# EAGLE schematic Module_BaseBoard _2.0 (EAGLE 9.2.1)

## Sheet 1 of 7: CM5 MODULE
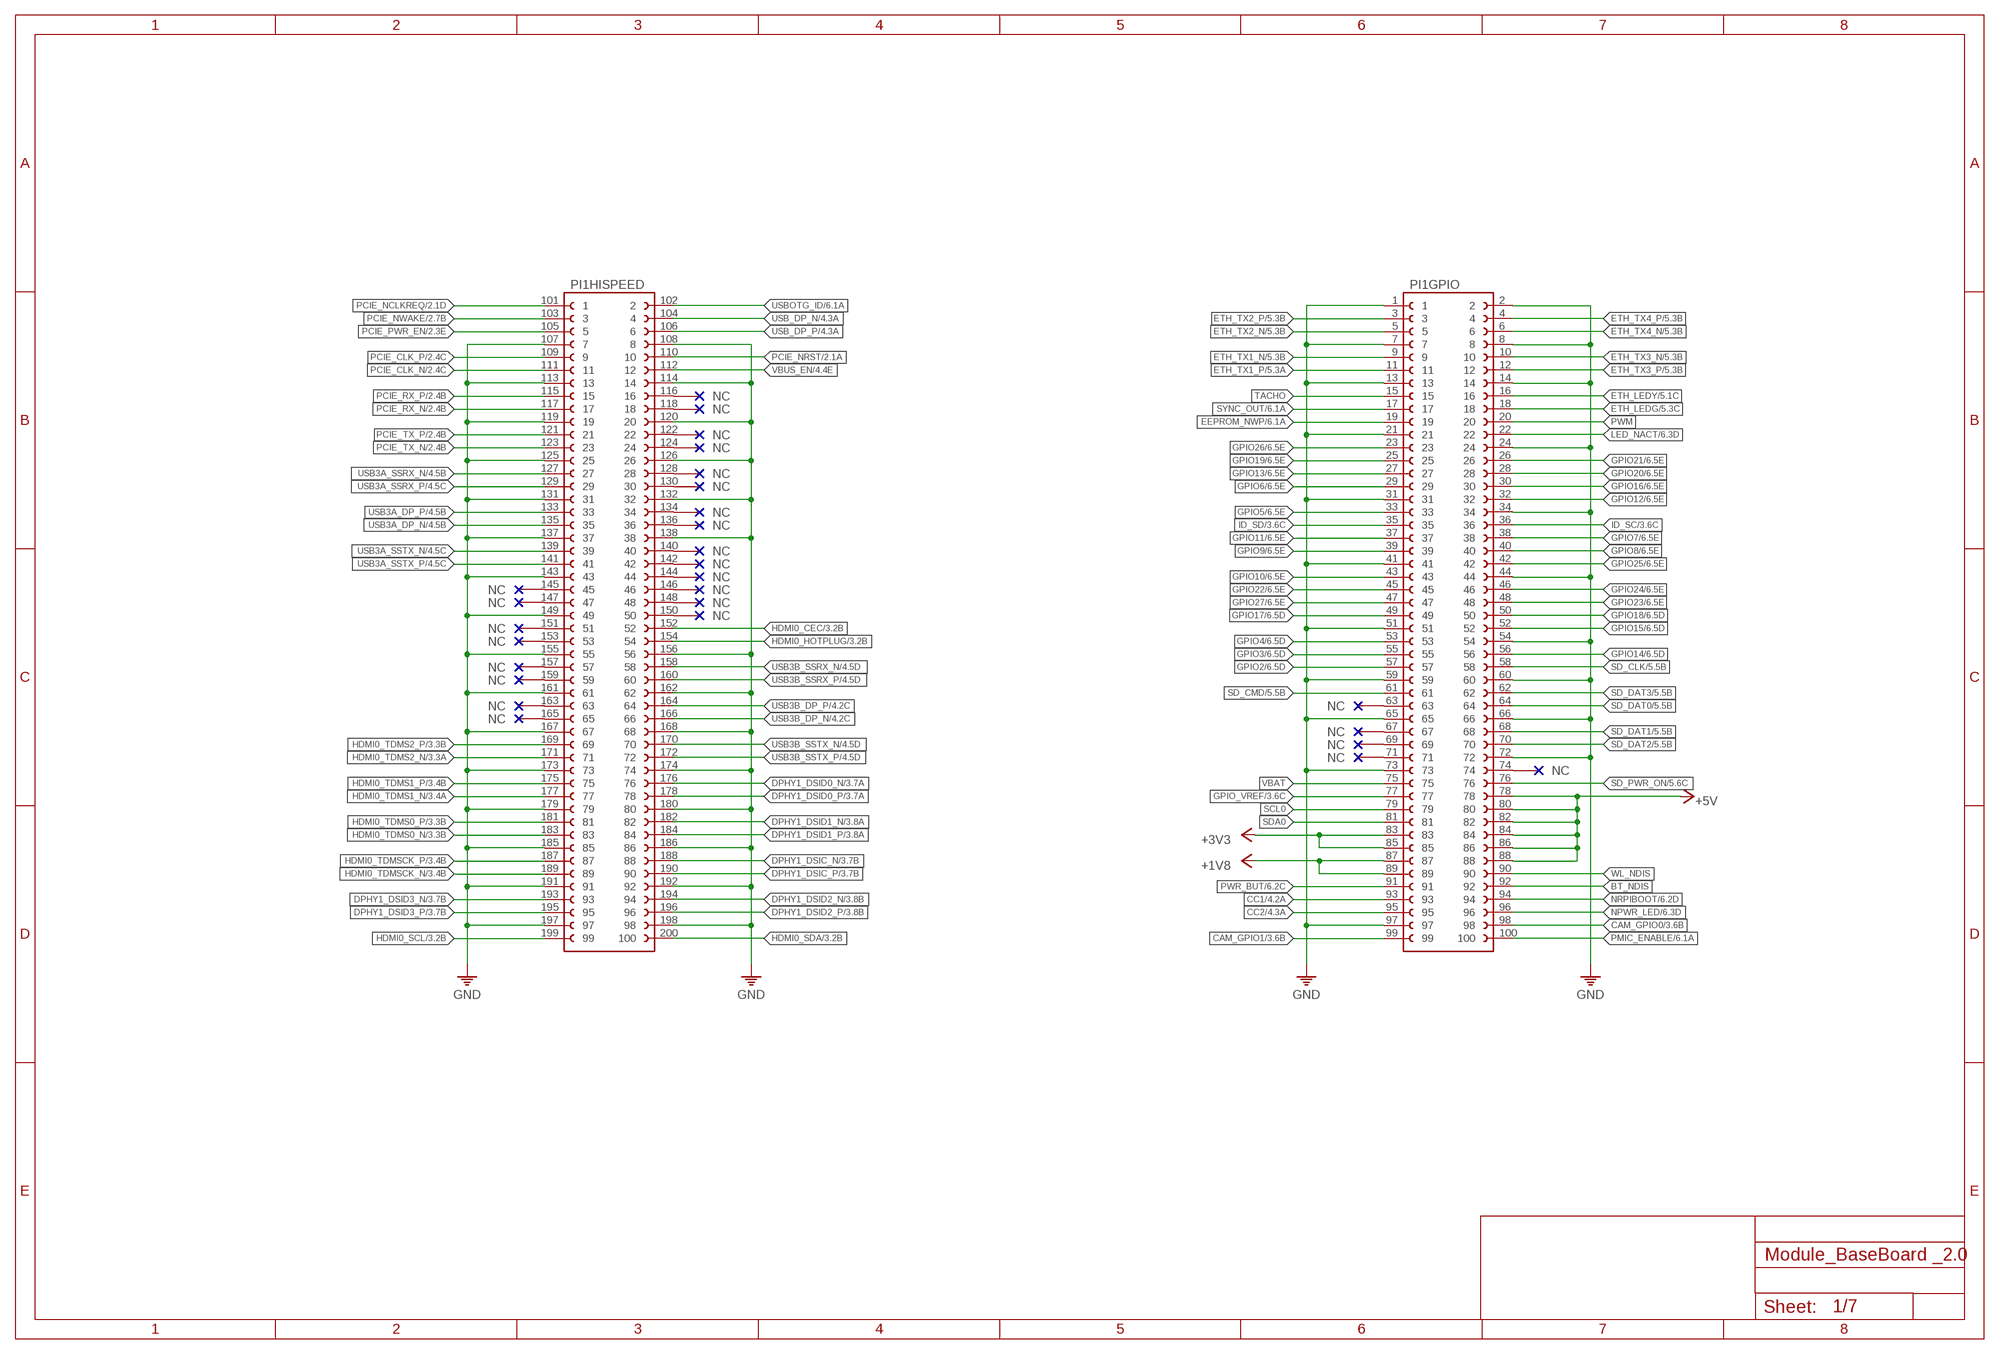
[diagram p0: schematic, sheet 1]

### Parts
PI1  RASPBERRY_CM5  [CM5]

### Nets
+1V8: PI1.87 PI1.89 ; also sheet 6
+3V3: PI1.83 PI1.85 ; also sheet 2,3,4,5,6,7
+5V: PI1.78 PI1.80 PI1.82 PI1.84 PI1.86 PI1.88 ; also sheet 2,3,4,6,7
BT_NDIS: PI1.92
CAM_GPIO0: PI1.98 ; also sheet 3
CAM_GPIO1: PI1.99 ; also sheet 3
CC1: PI1.93 ; also sheet 4
CC2: PI1.95 ; also sheet 4
DPHY1_DSIC_N [100R_DIFFPAIR]: PI1.188 ; also sheet 3
DPHY1_DSIC_P [100R_DIFFPAIR]: PI1.190 ; also sheet 3
DPHY1_DSID0_N [100R_DIFFPAIR]: PI1.176 ; also sheet 3
DPHY1_DSID0_P [100R_DIFFPAIR]: PI1.178 ; also sheet 3
DPHY1_DSID1_N [100R_DIFFPAIR]: PI1.182 ; also sheet 3
DPHY1_DSID1_P [100R_DIFFPAIR]: PI1.184 ; also sheet 3
DPHY1_DSID2_N [100R_DIFFPAIR]: PI1.194 ; also sheet 3
DPHY1_DSID2_P [100R_DIFFPAIR]: PI1.196 ; also sheet 3
DPHY1_DSID3_N [100R_DIFFPAIR]: PI1.193 ; also sheet 3
DPHY1_DSID3_P [100R_DIFFPAIR]: PI1.195 ; also sheet 3
EEPROM_NWP: PI1.19 ; also sheet 6
ETH_LEDG: PI1.18 ; also sheet 5
ETH_LEDY: PI1.16 ; also sheet 5
ETH_TX1_N [100R_DIFFPAIR]: PI1.9 ; also sheet 5
ETH_TX1_P [100R_DIFFPAIR]: PI1.11 ; also sheet 5
ETH_TX2_N [100R_DIFFPAIR]: PI1.5 ; also sheet 5
ETH_TX2_P [100R_DIFFPAIR]: PI1.3 ; also sheet 5
ETH_TX3_N [100R_DIFFPAIR]: PI1.10 ; also sheet 5
ETH_TX3_P [100R_DIFFPAIR]: PI1.12 ; also sheet 5
ETH_TX4_N [100R_DIFFPAIR]: PI1.6 ; also sheet 5
ETH_TX4_P [100R_DIFFPAIR]: PI1.4 ; also sheet 5
GND: PI1.1 PI1.2 PI1.7 PI1.8 PI1.13 PI1.14 PI1.21 PI1.24 PI1.31 PI1.34 PI1.41 PI1.44 PI1.51 PI1.54 PI1.59 PI1.60 PI1.65 PI1.66 PI1.72 PI1.73 PI1.97 PI1.107 PI1.108 PI1.113 PI1.114 PI1.119 PI1.120 PI1.125 PI1.126 PI1.131 PI1.132 PI1.137 PI1.138 PI1.143 PI1.149 PI1.155 PI1.156 PI1.161 PI1.162 PI1.167 PI1.168 PI1.173 PI1.174 PI1.179 PI1.180 PI1.185 PI1.186 PI1.191 PI1.192 PI1.197 PI1.198 ; also sheet 2,3,4,5,6,7
GPIO2: PI1.57 ; also sheet 6,7
GPIO3: PI1.55 ; also sheet 6,7
GPIO4: PI1.53 ; also sheet 6
GPIO5: PI1.33 ; also sheet 6
GPIO6: PI1.29 ; also sheet 6
GPIO7: PI1.38 ; also sheet 6
GPIO8: PI1.40 ; also sheet 6,7
GPIO9: PI1.39 ; also sheet 6,7
GPIO10: PI1.43 ; also sheet 6,7
GPIO11: PI1.37 ; also sheet 6,7
GPIO12: PI1.32 ; also sheet 6
GPIO13: PI1.27 ; also sheet 6
GPIO14: PI1.56 ; also sheet 6,7
GPIO15: PI1.52 ; also sheet 6,7
GPIO16: PI1.30 ; also sheet 6
GPIO17: PI1.49 ; also sheet 6
GPIO18: PI1.50 ; also sheet 6,7
GPIO19: PI1.25 ; also sheet 6,7
GPIO20: PI1.28 ; also sheet 6,7
GPIO21: PI1.26 ; also sheet 6,7
GPIO22: PI1.45 ; also sheet 6
GPIO23: PI1.48 ; also sheet 6
GPIO24: PI1.46 ; also sheet 6,7
GPIO25: PI1.42 ; also sheet 6,7
GPIO26: PI1.23 ; also sheet 6
GPIO27: PI1.47 ; also sheet 6
GPIO_VREF: PI1.77 ; also sheet 3,6
HDMI0_CEC: PI1.152 ; also sheet 3
HDMI0_HOTPLUG: PI1.154 ; also sheet 3
HDMI0_SCL: PI1.199 ; also sheet 3
HDMI0_SDA: PI1.200 ; also sheet 3
HDMI0_TDMS0_N [100R_DIFFPAIR]: PI1.183 ; also sheet 3
HDMI0_TDMS0_P [100R_DIFFPAIR]: PI1.181 ; also sheet 3
HDMI0_TDMS1_N [100R_DIFFPAIR]: PI1.177 ; also sheet 3
HDMI0_TDMS1_P [100R_DIFFPAIR]: PI1.175 ; also sheet 3
HDMI0_TDMS2_N [100R_DIFFPAIR]: PI1.171 ; also sheet 3
HDMI0_TDMS2_P [100R_DIFFPAIR]: PI1.169 ; also sheet 3
HDMI0_TDMSCK_N [100R_DIFFPAIR]: PI1.189 ; also sheet 3
HDMI0_TDMSCK_P [100R_DIFFPAIR]: PI1.187 ; also sheet 3
ID_SC: PI1.36 ; also sheet 3,6
ID_SD: PI1.35 ; also sheet 3,6
LED_NACT: PI1.22 ; also sheet 6
NPWR_LED: PI1.96 ; also sheet 6
NRPIBOOT: PI1.94 ; also sheet 6
PCIE_CLK_N [90R_DIFFPAIR]: PI1.111 ; also sheet 2
PCIE_CLK_P [90R_DIFFPAIR]: PI1.109 ; also sheet 2
PCIE_NCLKREQ: PI1.101 ; also sheet 2
PCIE_NRST: PI1.110 ; also sheet 2
PCIE_NWAKE: PI1.103 ; also sheet 2
PCIE_PWR_EN: PI1.105 ; also sheet 2
PCIE_RX_N [90R_DIFFPAIR]: PI1.117 ; also sheet 2
PCIE_RX_P [90R_DIFFPAIR]: PI1.115 ; also sheet 2
PCIE_TX_N [90R_DIFFPAIR]: PI1.123 ; also sheet 2
PCIE_TX_P [90R_DIFFPAIR]: PI1.121 ; also sheet 2
PMIC_ENABLE: PI1.100 ; also sheet 6
PWM: PI1.20
PWR_BUT: PI1.91 ; also sheet 6
SCL0: PI1.79
SD_CLK: PI1.58 ; also sheet 5
SD_CMD: PI1.61 ; also sheet 5
SD_DAT0: PI1.64 ; also sheet 5
SD_DAT1: PI1.68 ; also sheet 5
SD_DAT2: PI1.70 ; also sheet 5
SD_DAT3: PI1.62 ; also sheet 5
SD_PWR_ON: PI1.76 ; also sheet 5
SDA0: PI1.81
SYNC_OUT: PI1.17 ; also sheet 6
TACHO: PI1.15
USB3A_DP_N [90R_DIFFPAIR]: PI1.135 ; also sheet 4
USB3A_DP_P [90R_DIFFPAIR]: PI1.133 ; also sheet 4
USB3A_SSRX_N [90R_DIFFPAIR]: PI1.127 ; also sheet 4
USB3A_SSRX_P [90R_DIFFPAIR]: PI1.129 ; also sheet 4
USB3A_SSTX_N [90R_DIFFPAIR]: PI1.139 ; also sheet 4
USB3A_SSTX_P [90R_DIFFPAIR]: PI1.141 ; also sheet 4
USB3B_DP_N [90R_DIFFPAIR]: PI1.166 ; also sheet 4
USB3B_DP_P [90R_DIFFPAIR]: PI1.164 ; also sheet 4
USB3B_SSRX_N [90R_DIFFPAIR]: PI1.158 ; also sheet 4
USB3B_SSRX_P [90R_DIFFPAIR]: PI1.160 ; also sheet 4
USB3B_SSTX_N [90R_DIFFPAIR]: PI1.170 ; also sheet 4
USB3B_SSTX_P [90R_DIFFPAIR]: PI1.172 ; also sheet 4
USB_DP_N [90R_DIFFPAIR]: PI1.104 ; also sheet 4
USB_DP_P [90R_DIFFPAIR]: PI1.106 ; also sheet 4
USBOTG_ID: PI1.102 ; also sheet 6
VBAT: PI1.75
VBUS_EN: PI1.112 ; also sheet 4
WL_NDIS: PI1.90
Unconnected: PI1.63 PI1.67 PI1.69 PI1.71 PI1.74 PI1.116 PI1.118 PI1.122 PI1.124 PI1.128 PI1.130 PI1.134 PI1.136 PI1.140 PI1.142 PI1.144 PI1.145 PI1.146 PI1.147 PI1.148 PI1.150 PI1.151 PI1.153 PI1.157 PI1.159 PI1.163 PI1.165

## Sheet 2 of 7: CM5 PCIE-M2 INTERFACE
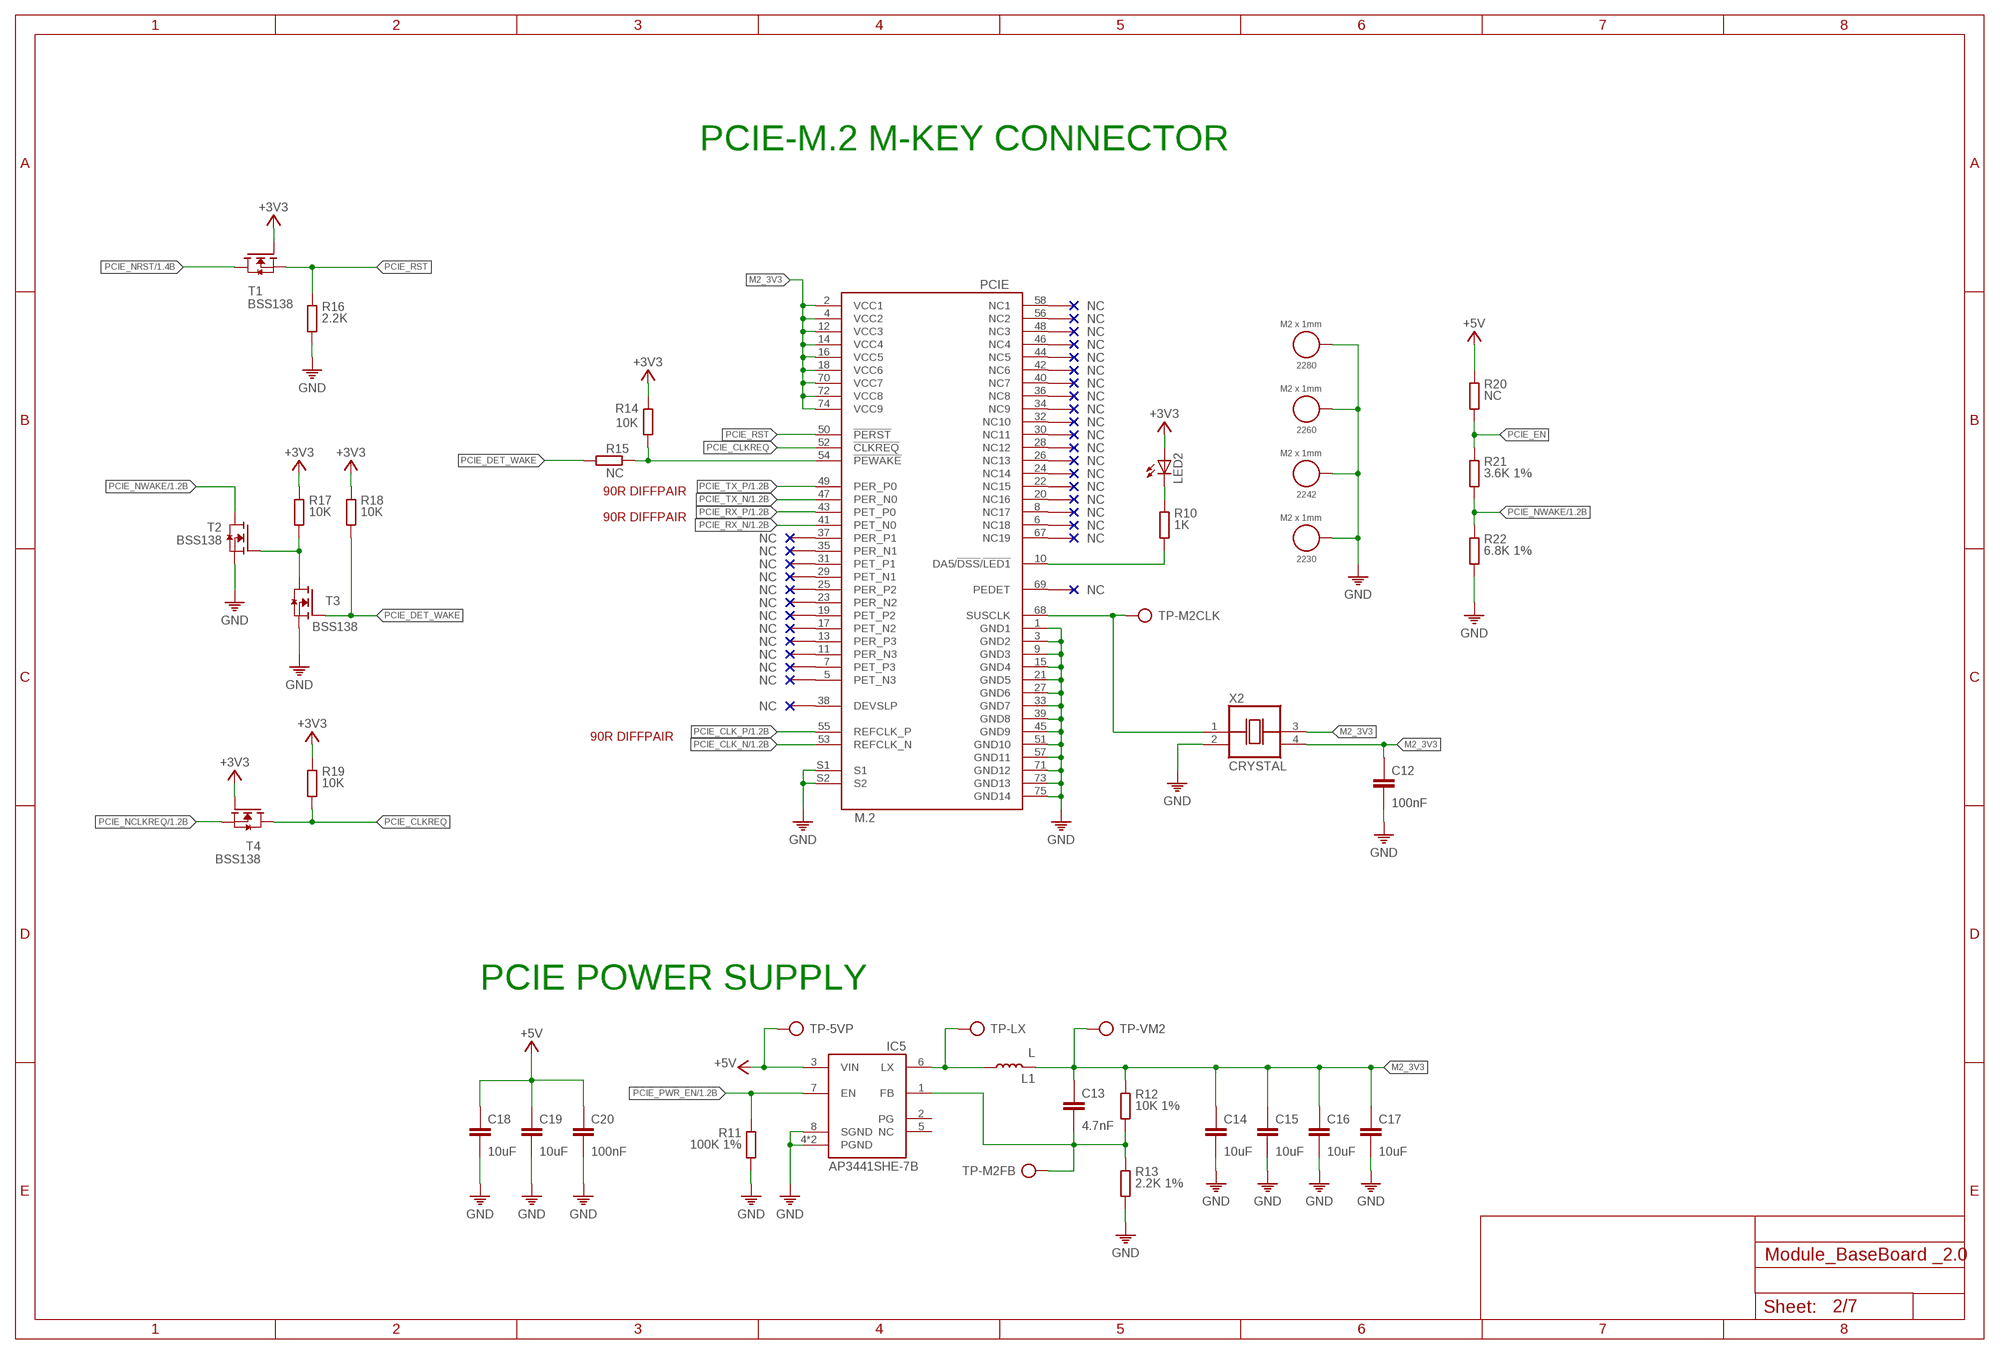
[diagram p1: schematic, sheet 2]

### Parts
2230  M2 x 1mm  WA-SMSI_9774XXX243_9774010243  [WA-SMSI_9774010243]
2242  M2 x 1mm  WA-SMSI_9774XXX243_9774010243  [WA-SMSI_9774010243]
2260  M2 x 1mm  WA-SMSI_9774XXX243_9774010243  [WA-SMSI_9774010243]
2280  M2 x 1mm  WA-SMSI_9774XXX243_9774010243  [WA-SMSI_9774010243]
C12  100nF  C-0402  [C0402]
C13  4.7nF  C-0402  [C0402]
C14  10uF  C-0805  [C0805]
C15  10uF  C-0805  [C0805]
C16  10uF  C-0805  [C0805]
C17  10uF  C-0805  [C0805]
C18  10uF  C-0805  [C0805]
C19  10uF  C-0805  [C0805]
C20  100nF  C-0402  [C0402]
IC5  AP3441SHE-7B  [SON50P201X201X56-9T90X170N]
L1  L  [SRR5228A]
LED2  LEDCHIPLED_0805  [CHIPLED_0805]
PCIE  M.2  [PCIE_M.2]
R10  1K  R0402  [0402]
R11  100K 1%  R0402  [0402]
R12  10K 1%  R0402  [0402]
R13  2.2K 1%  R0402  [0402]
R14  10K  R0402  [0402]
R15  NC  R0402  [0402]
R16  2.2K  R0402  [0402]
R17  10K  R0402  [0402]
R18  10K  R0402  [0402]
R19  10K  R0402  [0402]
R20  NC  R0402  [0402]
R21  3.6K 1%  R0402  [0402]
R22  6.8K 1%  R0402  [0402]
T1  BSS138  [SOT23]
T2  BSS138  [SOT23]
T3  BSS138  [SOT23]
T4  BSS138  [SOT23]
TP-5VP  TP  [TP]
TP-LX  TP  [TP]
TP-M2CLK  TP  [TP]
TP-M2FB  TP  [TP]
TP-VM2  TP  [TP]
X2  CRYSTAL  [OSCCC500X320X130]

### Nets
+3V3: LED2.A R14.1 R17.1 R18.1 R19.1 T1.1(G) T4.1(G) ; also sheet 1,3,4,5,6,7
+5V: C18.1 C19.1 C20.1 IC5.3(VIN) R20.1 TP-5VP.TP ; also sheet 1,3,4,6,7
GND: 2230.1 2242.1 2260.1 2280.1 C12.2 C14.2 C15.2 C16.2 C17.2 C18.2 C19.2 C20.2 IC5.4(PGND) IC5.8(SGND) IC5.9(PGND) PCIE.1(GND1) PCIE.3(GND2) PCIE.9(GND3) PCIE.15(GND4) PCIE.21(GND5) PCIE.27(GND6) PCIE.33(GND7) PCIE.39(GND8) PCIE.45(GND9) PCIE.51(GND10) PCIE.57(GND11) PCIE.71(GND12) PCIE.73(GND13) PCIE.75(GND14) PCIE.S1 PCIE.S2 R11.2 R13.2 R16.2 R22.2 T2.2(S) T3.2(S) X2.2(VSS) ; also sheet 1,3,4,5,6,7
M2_3V3: C12.1 C13.1 C14.1 C15.1 C16.1 C17.1 L1.2 PCIE.2(VCC1) PCIE.4(VCC2) PCIE.12(VCC3) PCIE.14(VCC4) PCIE.16(VCC5) PCIE.18(VCC6) PCIE.70(VCC7) PCIE.72(VCC8) PCIE.74(VCC9) R12.1 TP-VM2.TP X2.3(OUT) X2.4(VDD)
N$6: PCIE.10(DA5/!DSS!/!LED1) R10.2
N$7: LED2.C R10.1
N$9: IC5.6(LX) L1.1 TP-LX.TP
N$10: C13.2 IC5.1(FB) R12.2 R13.1 TP-M2FB.TP
N$11: PCIE.68(SUSCLK) TP-M2CLK.TP X2.1(CON)
N$12: PCIE.54(!PEWAKE) R14.2 R15.1
N$16: R17.2 T2.1(G) T3.3(D)
PCIE_CLK_N [90R_DIFFPAIR]: PCIE.53(REFCLK_N) ; also sheet 1
PCIE_CLK_P [90R_DIFFPAIR]: PCIE.55(REFCLK_P) ; also sheet 1
PCIE_CLKREQ: PCIE.52(!CLKREQ) R19.2 T4.3(D)
PCIE_DET_WAKE: R15.2 R18.2 T3.1(G)
PCIE_EN: R20.2 R21.1
PCIE_NCLKREQ: T4.2(S) ; also sheet 1
PCIE_NRST: T1.3(D) ; also sheet 1
PCIE_NWAKE: R21.2 R22.1 T2.3(D) ; also sheet 1
PCIE_PWR_EN: IC5.7(EN) R11.1 ; also sheet 1
PCIE_RST: PCIE.50(!PERST) R16.1 T1.2(S)
PCIE_RX_N [90R_DIFFPAIR]: PCIE.41(PET_N0) ; also sheet 1
PCIE_RX_P [90R_DIFFPAIR]: PCIE.43(PET_P0) ; also sheet 1
PCIE_TX_N [90R_DIFFPAIR]: PCIE.47(PER_N0) ; also sheet 1
PCIE_TX_P [90R_DIFFPAIR]: PCIE.49(PER_P0) ; also sheet 1
Unconnected: IC5.2(PG) IC5.5(NC) PCIE.5(PET_N3) PCIE.6(NC18) PCIE.7(PET_P3) PCIE.8(NC17) PCIE.11(PER_N3) PCIE.13(PER_P3) PCIE.17(PET_N2) PCIE.19(PET_P2) PCIE.20(NC16) PCIE.22(NC15) PCIE.23(PER_N2) PCIE.24(NC14) PCIE.25(PER_P2) PCIE.26(NC13) PCIE.28(NC12) PCIE.29(PET_N1) PCIE.30(NC11) PCIE.31(PET_P1) PCIE.32(NC10) PCIE.34(NC9) PCIE.35(PER_N1) PCIE.36(NC8) PCIE.37(PER_P1) PCIE.38(DEVSLP) PCIE.40(NC7) PCIE.42(NC6) PCIE.44(NC5) PCIE.46(NC4) PCIE.48(NC3) PCIE.56(NC2) PCIE.58(NC1) PCIE.67(NC19) PCIE.69(PEDET)

### Notes on the sheet
- PCIE-M.2 M-KEY CONNECTOR
- 90R DIFFPAIR
- 90R DIFFPAIR
- 90R DIFFPAIR
- PCIE POWER SUPPLY

## Sheet 3 of 7: HDMI AND DSI INTERFACE
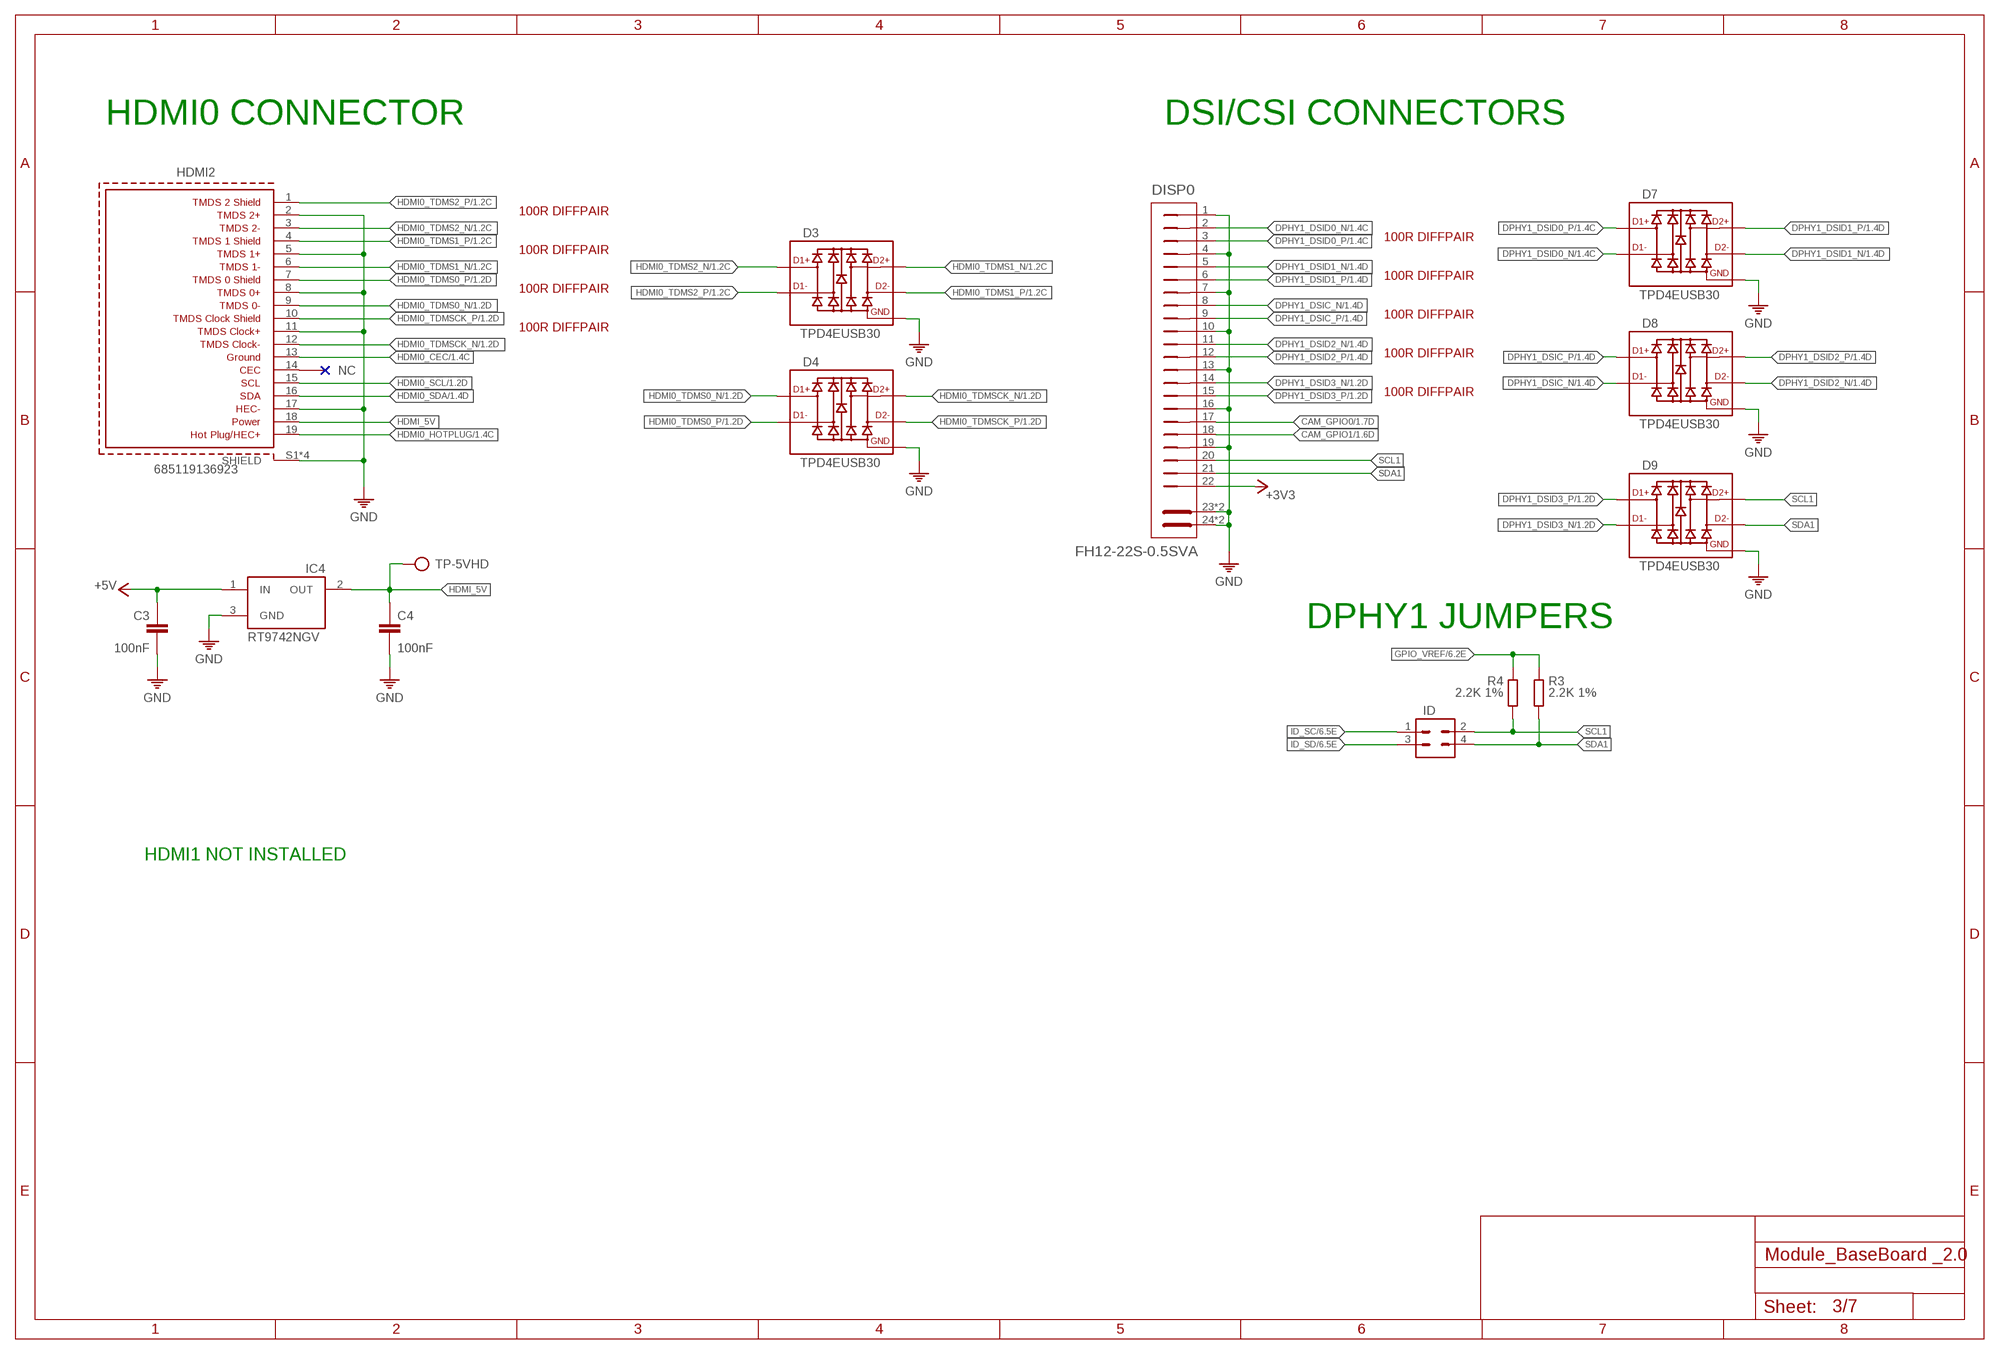
[diagram p2: schematic, sheet 3]

### Parts
C3  100nF  C-0402  [C0402]
C4  100nF  C-0402  [C0402]
D3  TPD4EUSB30  [USON]
D4  TPD4EUSB30  [USON]
D7  TPD4EUSB30  [USON]
D8  TPD4EUSB30  [USON]
D9  TPD4EUSB30  [USON]
DISP0  FH12-22S-0.5SVA  [FH12-22S-0.5SH]
HDMI2  685119136923  [685119136923]
IC4  RT9742NGV  [SOT23]
ID  CON-2X2  [2X2]
R3  2.2K 1%  R0402  [0402]
R4  2.2K 1%  R0402  [0402]
TP-5VHD  TP  [TP]

### Nets
+3V3: DISP0.22 ; also sheet 1,2,4,5,6,7
+5V: C3.1 IC4.1(IN) ; also sheet 1,2,4,6,7
CAM_GPIO0: DISP0.17 ; also sheet 1
CAM_GPIO1: DISP0.18 ; also sheet 1
DPHY1_DSIC_N [100R_DIFFPAIR]: D8.5(D2-) D8.6(D2-) DISP0.8 ; also sheet 1
DPHY1_DSIC_P [100R_DIFFPAIR]: D8.4(D2+) D8.7(D2+) DISP0.9 ; also sheet 1
DPHY1_DSID0_N [100R_DIFFPAIR]: D7.5(D2-) D7.6(D2-) DISP0.2 ; also sheet 1
DPHY1_DSID0_P [100R_DIFFPAIR]: D7.4(D2+) D7.7(D2+) DISP0.3 ; also sheet 1
DPHY1_DSID1_N [100R_DIFFPAIR]: D7.2(D1-) D7.9(D1-) DISP0.5 ; also sheet 1
DPHY1_DSID1_P [100R_DIFFPAIR]: D7.1(D1+) D7.10(D1+) DISP0.6 ; also sheet 1
DPHY1_DSID2_N [100R_DIFFPAIR]: D8.2(D1-) D8.9(D1-) DISP0.11 ; also sheet 1
DPHY1_DSID2_P [100R_DIFFPAIR]: D8.1(D1+) D8.10(D1+) DISP0.12 ; also sheet 1
DPHY1_DSID3_N [100R_DIFFPAIR]: D9.5(D2-) D9.6(D2-) DISP0.14 ; also sheet 1
DPHY1_DSID3_P [100R_DIFFPAIR]: D9.4(D2+) D9.7(D2+) DISP0.15 ; also sheet 1
GND: C3.2 C4.2 D3.3(GND) D3.8(GND) D4.3(GND) D4.8(GND) D7.3(GND) D7.8(GND) D8.3(GND) D8.8(GND) D9.3(GND) D9.8(GND) DISP0.1 DISP0.4 DISP0.7 DISP0.10 DISP0.13 DISP0.16 DISP0.19 DISP0.23(MH1) DISP0.24(MH2) DISP0.25(MH1) DISP0.26(MH2) HDMI2.2(TMDS2+) HDMI2.5(TMDSDATA1+) HDMI2.8(TMDS0+) HDMI2.11(TMDSCLOCK+) HDMI2.17(UTILITY/HEAC+) HDMI2.S1(SHIELD) HDMI2.S2(SHIELD) HDMI2.S3(SHIELD) HDMI2.S4(SHIELD) IC4.3(GND) ; also sheet 1,2,4,5,6,7
GPIO_VREF: R3.1 R4.1 ; also sheet 1,6
HDMI0_CEC: HDMI2.13(GROUND) ; also sheet 1
HDMI0_HOTPLUG: HDMI2.19(HOTPLUG/HEC+) ; also sheet 1
HDMI0_SCL: HDMI2.15(SCL) ; also sheet 1
HDMI0_SDA: HDMI2.16(SDA) ; also sheet 1
HDMI0_TDMS0_N [100R_DIFFPAIR]: D4.4(D2+) D4.7(D2+) HDMI2.9(TMDS0-) ; also sheet 1
HDMI0_TDMS0_P [100R_DIFFPAIR]: D4.5(D2-) D4.6(D2-) HDMI2.7(TMDS0SHIELD) ; also sheet 1
HDMI0_TDMS1_N [100R_DIFFPAIR]: D3.1(D1+) D3.10(D1+) HDMI2.6(TMDS1-) ; also sheet 1
HDMI0_TDMS1_P [100R_DIFFPAIR]: D3.2(D1-) D3.9(D1-) HDMI2.4(TMDS1SHIELD) ; also sheet 1
HDMI0_TDMS2_N [100R_DIFFPAIR]: D3.4(D2+) D3.7(D2+) HDMI2.3(TMDS2-) ; also sheet 1
HDMI0_TDMS2_P [100R_DIFFPAIR]: D3.5(D2-) D3.6(D2-) HDMI2.1(TMDS2SHIELD) ; also sheet 1
HDMI0_TDMSCK_N [100R_DIFFPAIR]: D4.1(D1+) D4.10(D1+) HDMI2.12(TMDSCLOCK-) ; also sheet 1
HDMI0_TDMSCK_P [100R_DIFFPAIR]: D4.2(D1-) D4.9(D1-) HDMI2.10(TMDSCLOCKSHIELD) ; also sheet 1
HDMI_5V: C4.1 HDMI2.18(POWER) IC4.2(OUT) TP-5VHD.TP
ID_SC: ID.1 ; also sheet 1,6
ID_SD: ID.3 ; also sheet 1,6
SCL1: D9.1(D1+) D9.10(D1+) DISP0.20 ID.2 R4.2
SDA1: D9.2(D1-) D9.9(D1-) DISP0.21 ID.4 R3.2
Unconnected: HDMI2.14(CEC)

### Notes on the sheet
- HDMI0 CONNECTOR | DSI/CSI CONNECTORS
- 100R DIFFPAIR
- 100R DIFFPAIR
- 100R DIFFPAIR
- 100R DIFFPAIR
- 100R DIFFPAIR
- 100R DIFFPAIR
- 100R DIFFPAIR
- 100R DIFFPAIR
- 100R DIFFPAIR
- DPHY1 JUMPERS
- HDMI1 NOT INSTALLED

## Sheet 4 of 7: USB INTERFACES
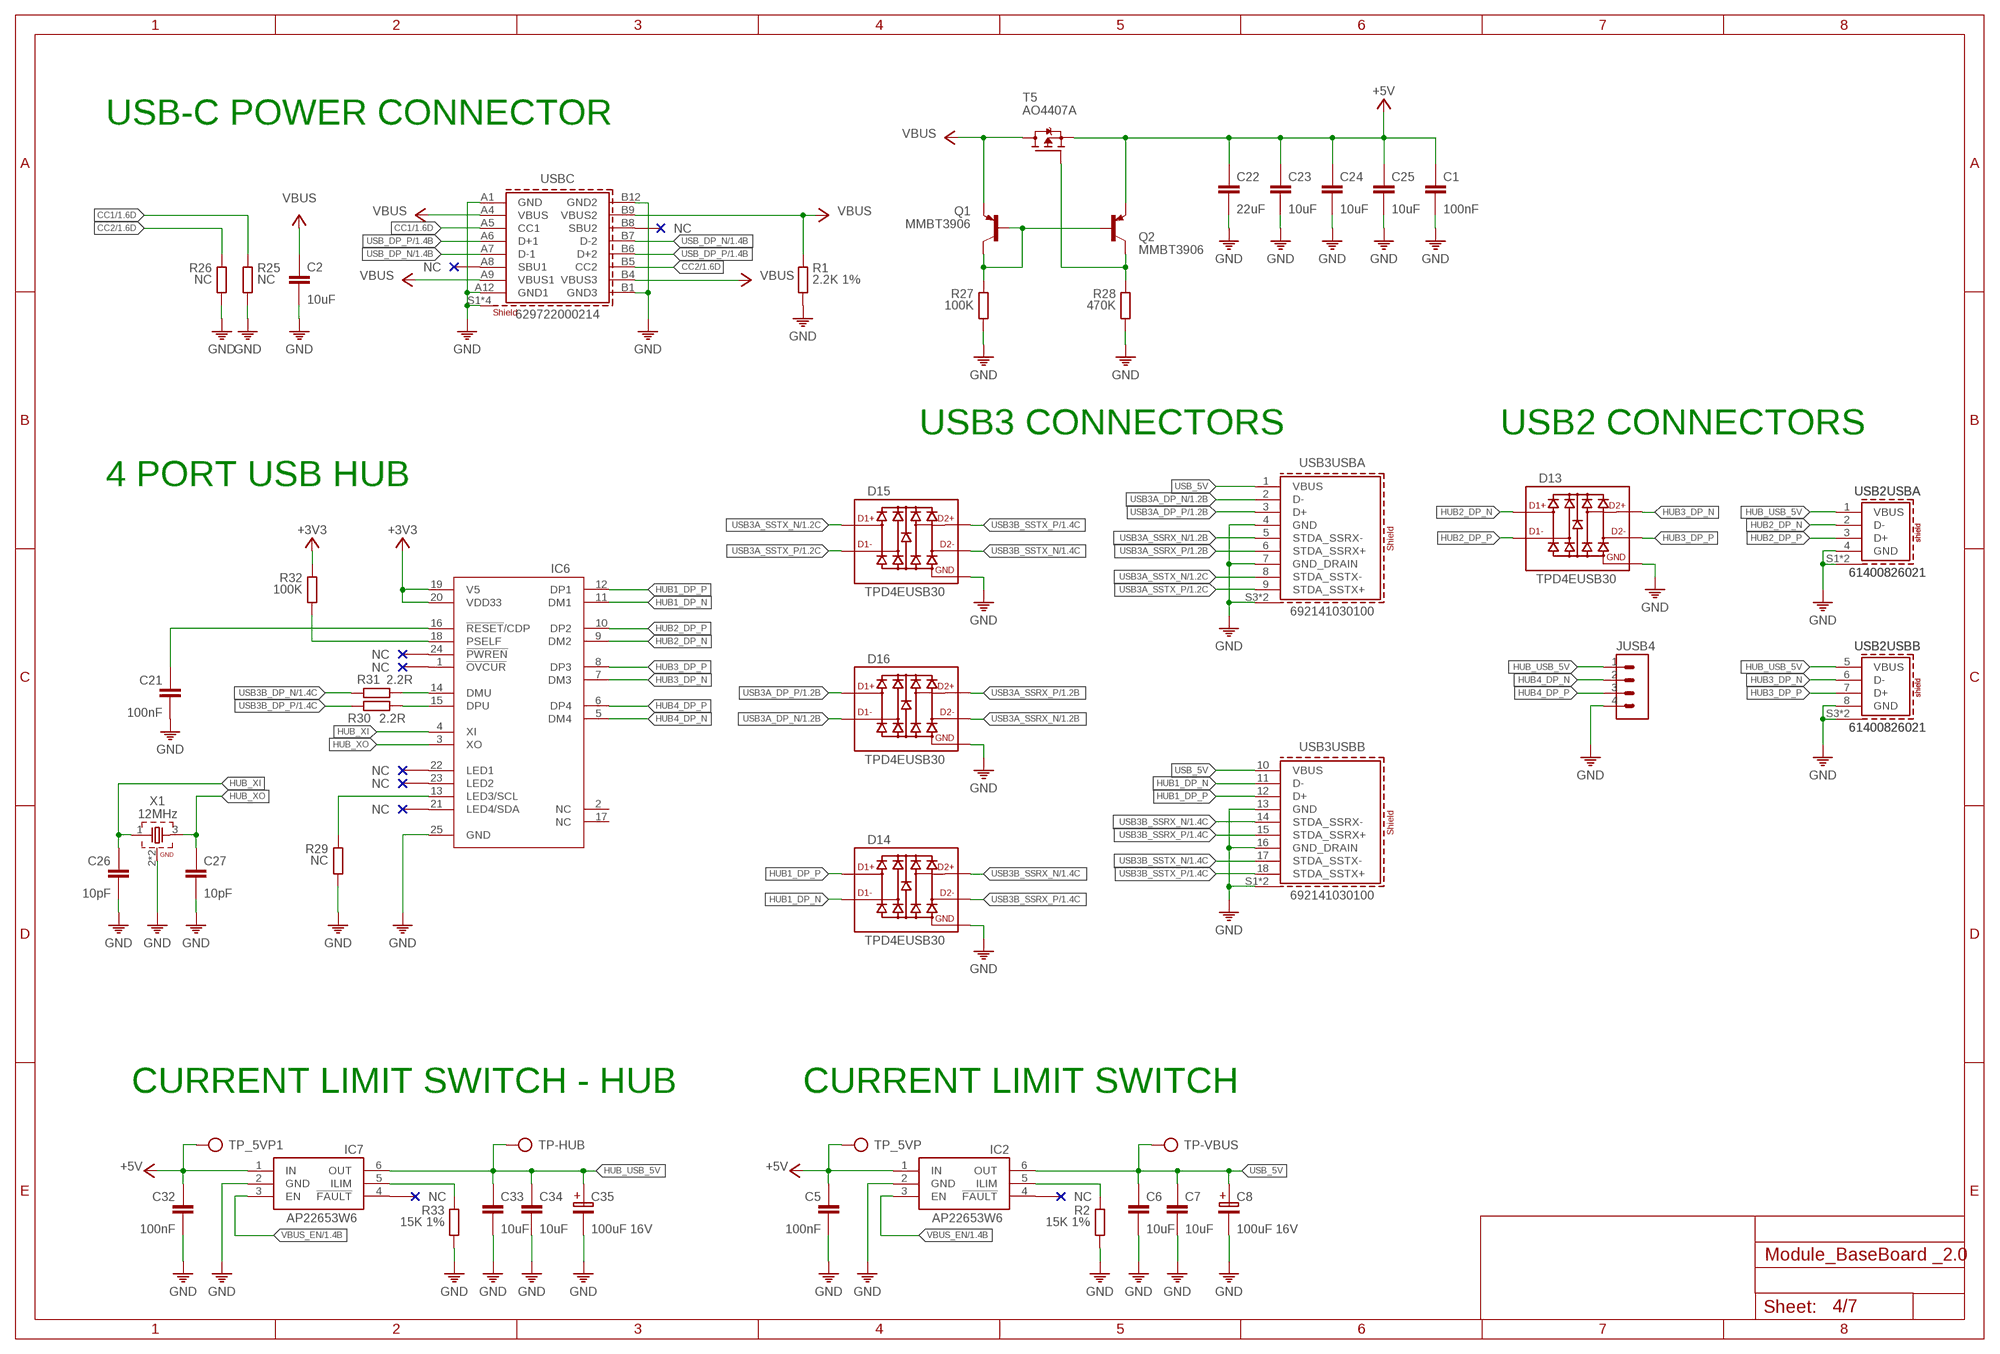
[diagram p3: schematic, sheet 4]

### Parts
C1  100nF  C-0805  [C0805]
C2  10uF  C-0805  [C0805]
C5  100nF  C-0402  [C0402]
C6  10uF  C-0805  [C0805]
C7  10uF  C-0805  [C0805]
C8  100uF 16V  CPOL  [100UF-16V]
C21  100nF  C-0402  [C0402]
C22  22uF  C-0805  [C0805]
C23  10uF  C-0805  [C0805]
C24  10uF  C-0805  [C0805]
C25  10uF  C-0805  [C0805]
C26  10pF  C-0402  [C0402]
C27  10pF  C-0402  [C0402]
C32  100nF  C-0402  [C0402]
C33  10uF  C-0805  [C0805]
C34  10uF  C-0805  [C0805]
C35  100uF 16V  CPOL  [100UF-16V]
D13  TPD4EUSB30  [USON]
D14  TPD4EUSB30  [USON]
D15  TPD4EUSB30  [USON]
D16  TPD4EUSB30  [USON]
IC2  AP22653W6  [SOT23-6]
IC6  CH334  [QFN24]
IC7  AP22653W6  [SOT23-6]
JUSB4  CON-1X4  [1X4]
Q1  MMBT3906  [SOT23]
Q2  MMBT3906  [SOT23]
R1  2.2K 1%  R0402  [0402]
R2  15K 1%  R0402  [0402]
R25  NC  R0402  [0402]
R26  NC  R0402  [0402]
R27  100K  R0402  [0402]
R28  470K  R0402  [0402]
R29  NC  R0402  [0402]
R30  2.2R  R0402  [0402]
R31  2.2R  R0402  [0402]
R32  100K  R0402  [0402]
R33  15K 1%  R0402  [0402]
T5  AO4407A  [SO8]
TP-HUB  TP  [TP]
TP-VBUS  TP  [TP]
TP_5VP  TP  [TP]
TP_5VP1  TP  [TP]
USB2  61400826021  61400826021  [61400826021]
USB3  692141030100  [692141030100]
USBC  629722000214  [629722000214]
X1  12MHz  WE-XTAL_CFPX-180_830035266  [WE-XTAL_CFPX-180]

### Nets
+3V3: IC6.19(V5) IC6.20(VDD33) R32.1 ; also sheet 1,2,3,5,6,7
+5V: C1.1 C5.1 C22.1 C23.1 C24.1 C25.1 C32.1 IC2.1(IN) IC7.1(IN) Q2.2(E) T5.1(S) T5.2(S) T5.3(S) TP_5VP1.TP TP_5VP.TP ; also sheet 1,2,3,6,7
CC1: R25.1 USBC.A5(CC1) ; also sheet 1
CC2: R26.1 USBC.B5(CC2) ; also sheet 1
GND: C1.2 C2.2 C5.2 C6.2 C7.2 C8.2 C21.2 C22.2 C23.2 C24.2 C25.2 C26.2 C27.2 C32.2 C33.2 C34.2 C35.2 D13.3(GND) D13.8(GND) D14.3(GND) D14.8(GND) D15.3(GND) D15.8(GND) D16.3(GND) D16.8(GND) IC2.2(GND) IC6.25(GND) IC7.2(GND) JUSB4.4 R1.2 R2.2 R25.2 R26.2 R27.2 R28.2 R29.2 R33.2 USB2.4(USBA:GND) USB2.8(USBB:GND) USB2.S1(USBA:SHIELD) USB2.S2(USBA:SHIELD) USB2.S3(USBB:SHIELD) USB2.S4(USBB:SHIELD) USB3.4(USBA:GND) USB3.7(USBA:GND_DRAIN) USB3.13(USBB:GND) USB3.16(USBB:GND_DRAIN) USB3.S1(USBB:SHIELD) USB3.S2(USBB:SHIELD) USB3.S3(USBA:SHIELD) USB3.S4(USBA:SHIELD) USBC.A1(GND) USBC.A12(GND1) USBC.B1(GND3) USBC.B12(GND2) USBC.S1(SHIELD) USBC.S2(SHIELD) USBC.S3(SHIELD) USBC.S4(SHIELD) X1.2(GND) X1.4(GND) ; also sheet 1,2,3,5,6,7
HUB1_DP_N [90R_DIFFPAIR]: D14.5(D2-) D14.6(D2-) IC6.11(DM1) USB3.11(USBB:D-)
HUB1_DP_P [90R_DIFFPAIR]: D14.4(D2+) D14.7(D2+) IC6.12(DP1) USB3.12(USBB:D+)
HUB2_DP_N [90R_DIFFPAIR]: D13.4(D2+) D13.7(D2+) IC6.9(DM2) USB2.2(USBA:D-)
HUB2_DP_P [90R_DIFFPAIR]: D13.5(D2-) D13.6(D2-) IC6.10(DP2) USB2.3(USBA:D+)
HUB3_DP_N [90R_DIFFPAIR]: D13.1(D1+) D13.10(D1+) IC6.7(DM3) USB2.6(USBB:D-)
HUB3_DP_P [90R_DIFFPAIR]: D13.2(D1-) D13.9(D1-) IC6.8(DP3) USB2.7(USBB:D+)
HUB4_DP_N [90R_DIFFPAIR]: IC6.5(DM4) JUSB4.2
HUB4_DP_P [90R_DIFFPAIR]: IC6.6(DP4) JUSB4.3
HUB_USB_5V: C33.1 C34.1 C35.1 IC7.6(OUT) JUSB4.1 TP-HUB.TP USB2.1(USBA:VBUS) USB2.5(USBB:VBUS)
HUB_XI: C26.1 IC6.4(XI) X1.1
HUB_XO: C27.1 IC6.3(XO) X1.3
N$1: IC2.5(ILIM) R2.1
N$13: C21.1 IC6.16(!RESET!/CDP)
N$14: Q1.1(B) Q1.3(C) Q2.1(B) R27.1
N$15: Q2.3(C) R28.1 T5.4(G)
N$17: IC6.18(PSELF) R32.2
N$18: IC6.13(LED3/SCL) R29.1
N$21: IC7.5(ILIM) R33.1
USB3A_DP_N [90R_DIFFPAIR]: D16.5(D2-) D16.6(D2-) USB3.2(USBA:D-) ; also sheet 1
USB3A_DP_P [90R_DIFFPAIR]: D16.4(D2+) D16.7(D2+) USB3.3(USBA:D+) ; also sheet 1
USB3A_SSRX_N [90R_DIFFPAIR]: D16.2(D1-) D16.9(D1-) USB3.5(USBA:STDA_SSRX-) ; also sheet 1
USB3A_SSRX_P [90R_DIFFPAIR]: D16.1(D1+) D16.10(D1+) USB3.6(USBA:STDA_SSRX+) ; also sheet 1
USB3A_SSTX_N [90R_DIFFPAIR]: D15.4(D2+) D15.7(D2+) USB3.8(USBA:STDA_SSTX-) ; also sheet 1
USB3A_SSTX_P [90R_DIFFPAIR]: D15.5(D2-) D15.6(D2-) USB3.9(USBA:STDA_SSTX+) ; also sheet 1
USB3B2_DP_N [90R_DIFFPAIR]: IC6.14(DMU) R31.2
USB3B2_DP_P [90R_DIFFPAIR]: IC6.15(DPU) R30.2
USB3B_DP_N [90R_DIFFPAIR]: R31.1 ; also sheet 1
USB3B_DP_P [90R_DIFFPAIR]: R30.1 ; also sheet 1
USB3B_SSRX_N [90R_DIFFPAIR]: D14.1(D1+) D14.10(D1+) USB3.14(USBB:STDA_SSRX-) ; also sheet 1
USB3B_SSRX_P [90R_DIFFPAIR]: D14.2(D1-) D14.9(D1-) USB3.15(USBB:STDA_SSRX+) ; also sheet 1
USB3B_SSTX_N [90R_DIFFPAIR]: D15.2(D1-) D15.9(D1-) USB3.17(USBB:STDA_SSTX-) ; also sheet 1
USB3B_SSTX_P [90R_DIFFPAIR]: D15.1(D1+) D15.10(D1+) USB3.18(USBB:STDA_SSTX+) ; also sheet 1
USB_5V: C6.1 C7.1 C8.1 IC2.6(OUT) TP-VBUS.TP USB3.1(USBA:VBUS) USB3.10(USBB:VBUS)
USB_DP_N [90R_DIFFPAIR]: USBC.A7(D-1) USBC.B7(D-2) ; also sheet 1
USB_DP_P [90R_DIFFPAIR]: USBC.A6(D+1) USBC.B6(D+2) ; also sheet 1
VBUS: C2.1 Q1.2(E) R1.1 T5.5(D) T5.6(D) T5.7(D) T5.8(D) USBC.A4(VBUS) USBC.A9(VBUS1) USBC.B4(VBUS3) USBC.B9(VBUS2)
VBUS_EN: IC2.3(EN) IC7.3(EN) ; also sheet 1
Unconnected: IC2.4(!FAULT) IC6.1(!OVCUR) IC6.2(NC) IC6.17(NC) IC6.21(LED4/SDA) IC6.22(LED1) IC6.23(LED2) IC6.24(!PWREN) IC7.4(!FAULT) USBC.A8(SBU1) USBC.B8(SBU2)

### Notes on the sheet
- USB-C POWER CONNECTOR
- USB3 CONNECTORS | USB2 CONNECTORS
- 4 PORT USB HUB
- CURRENT LIMIT SWITCH - HUB | CURRENT LIMIT SWITCH

## Sheet 5 of 7: ETHERNET AND MICRO SD
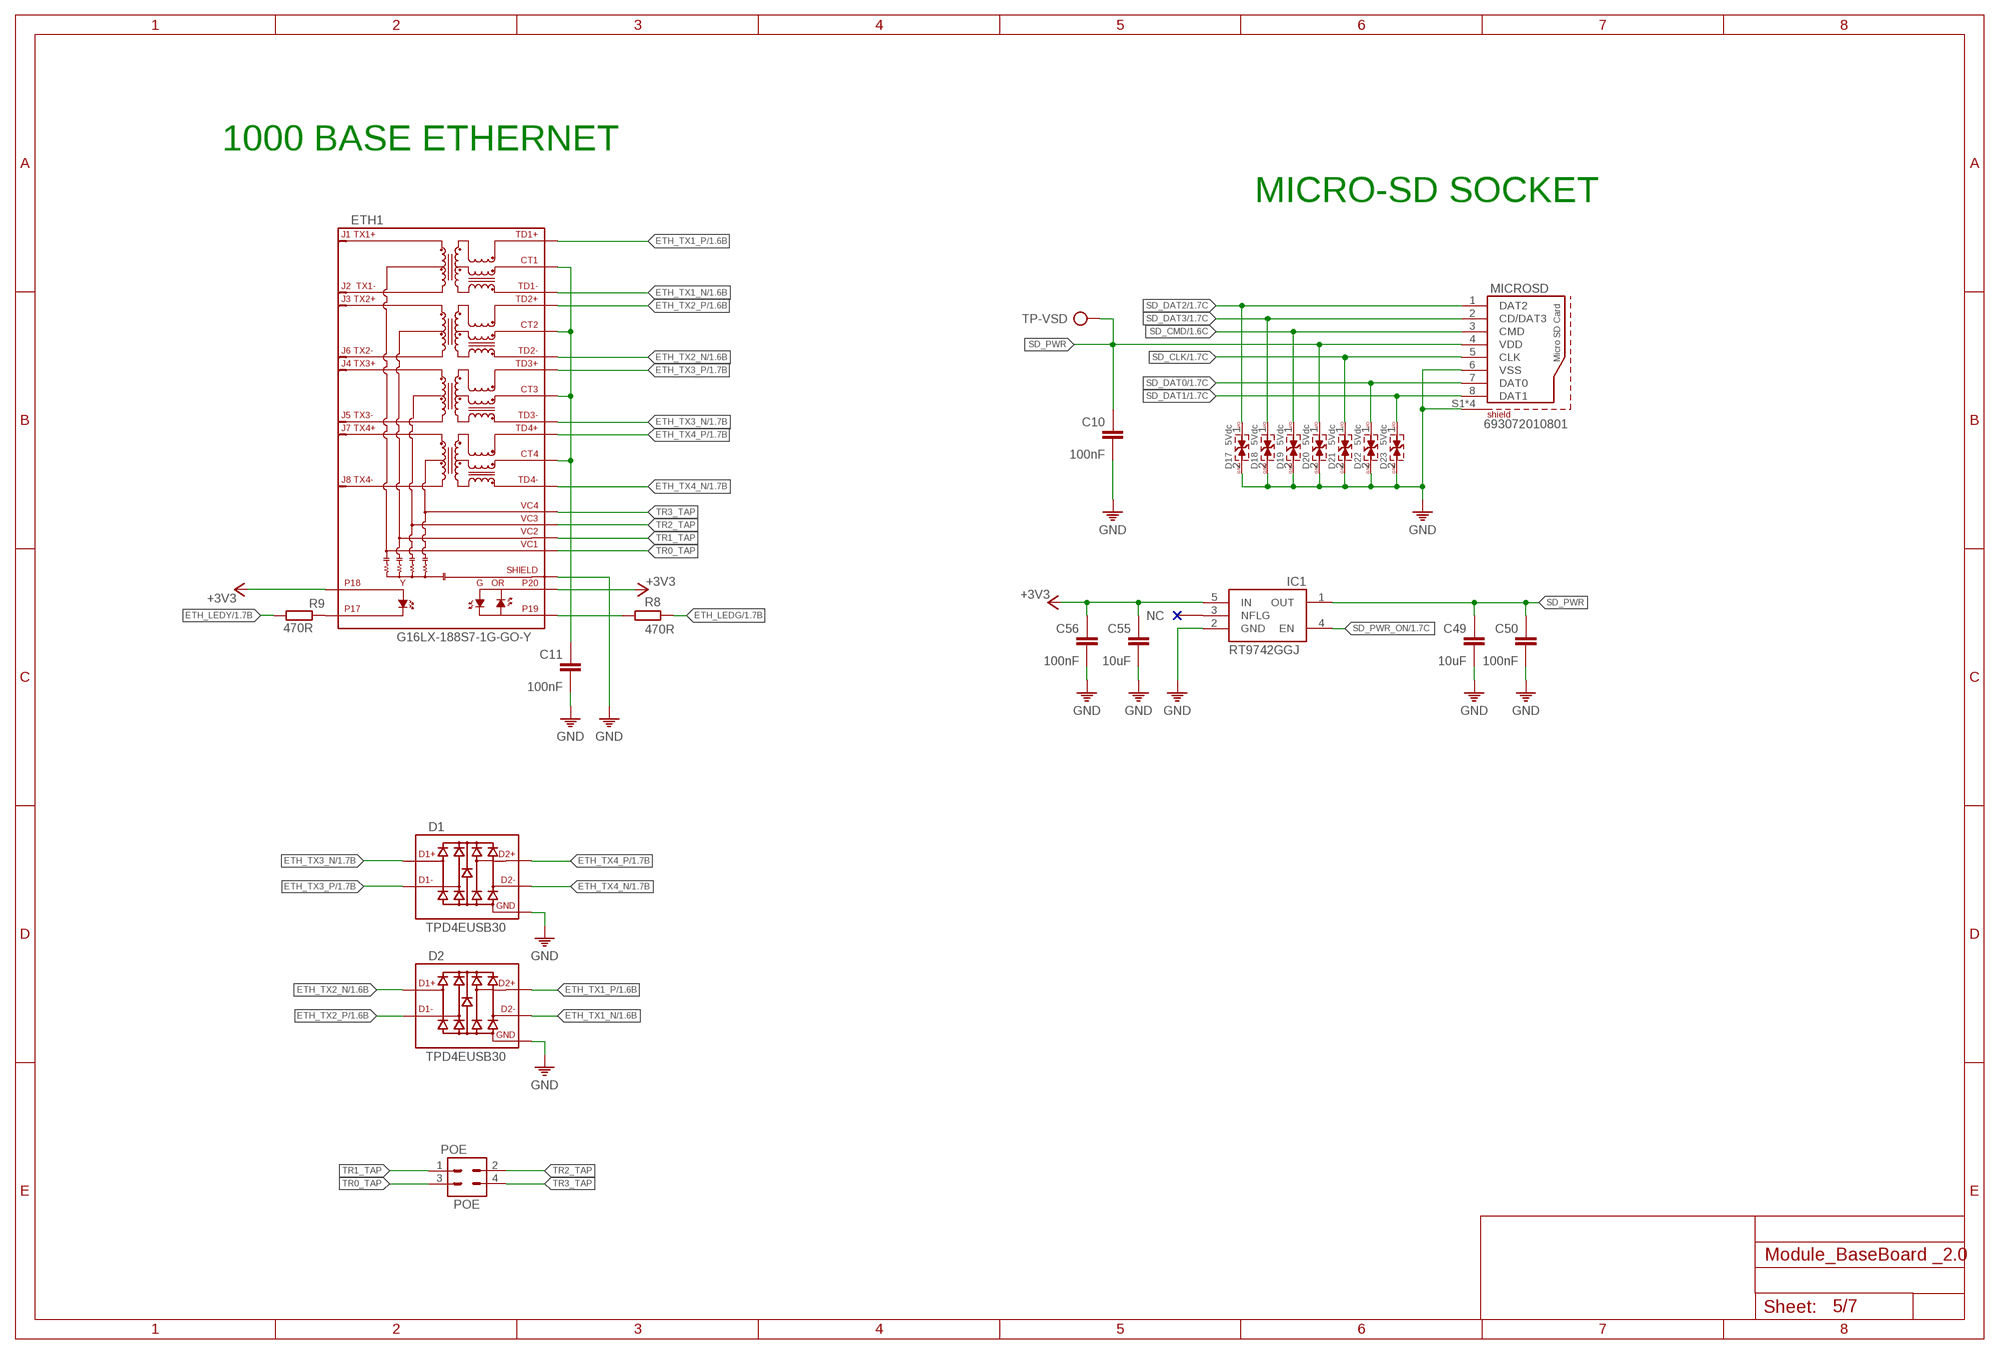
[diagram p4: schematic, sheet 5]

### Parts
C10  100nF  C-0402  [C0402]
C11  100nF  C-1206  [C1206]
C49  10uF  C-0805  [C0805]
C50  100nF  C-0402  [C0402]
C55  10uF  C-0805  [C0805]
C56  100nF  C-0402  [C0402]
D1  TPD4EUSB30  [USON]
D2  TPD4EUSB30  [USON]
D17  5Vdc  WE-TVS_DFN1610-2L_824032815  [WE-TVS_DFN1610-2L]
D18  5Vdc  WE-TVS_DFN1610-2L_824032815  [WE-TVS_DFN1610-2L]
D19  5Vdc  WE-TVS_DFN1610-2L_824032815  [WE-TVS_DFN1610-2L]
D20  5Vdc  WE-TVS_DFN1610-2L_824032815  [WE-TVS_DFN1610-2L]
D21  5Vdc  WE-TVS_DFN1610-2L_824032815  [WE-TVS_DFN1610-2L]
D22  5Vdc  WE-TVS_DFN1610-2L_824032815  [WE-TVS_DFN1610-2L]
D23  5Vdc  WE-TVS_DFN1610-2L_824032815  [WE-TVS_DFN1610-2L]
ETH1  G16LX-188S7-1G-GO-Y  RJ45-CAT6-POE  [RJ45-CAT6-POE]
IC1  RT9742GGJ  RT9742GGJ5  [SOT23-5]
MICROSD  693072010801  [693072010801]
POE  POE  CON-2X2  [2X2]
R8  470R  R0402  [0402]
R9  470R  R0402  [0402]
TP-VSD  TP  [TP]

### Nets
+3V3: C55.1 C56.1 ETH1.18 ETH1.20 IC1.5(IN) ; also sheet 1,2,3,4,6,7
ETH_LEDG: R8.1 ; also sheet 1
ETH_LEDY: R9.2 ; also sheet 1
ETH_TX1_N [100R_DIFFPAIR]: D2.2(D1-) D2.9(D1-) ETH1.TD1- ; also sheet 1
ETH_TX1_P [100R_DIFFPAIR]: D2.1(D1+) D2.10(D1+) ETH1.TD1+ ; also sheet 1
ETH_TX2_N [100R_DIFFPAIR]: D2.4(D2+) D2.7(D2+) ETH1.TD2- ; also sheet 1
ETH_TX2_P [100R_DIFFPAIR]: D2.5(D2-) D2.6(D2-) ETH1.TD2+ ; also sheet 1
ETH_TX3_N [100R_DIFFPAIR]: D1.4(D2+) D1.7(D2+) ETH1.TD3- ; also sheet 1
ETH_TX3_P [100R_DIFFPAIR]: D1.5(D2-) D1.6(D2-) ETH1.TD3+ ; also sheet 1
ETH_TX4_N [100R_DIFFPAIR]: D1.2(D1-) D1.9(D1-) ETH1.TD4- ; also sheet 1
ETH_TX4_P [100R_DIFFPAIR]: D1.1(D1+) D1.10(D1+) ETH1.TD4+ ; also sheet 1
GND: C10.2 C11.2 C49.2 C50.2 C55.2 C56.2 D1.3(GND) D1.8(GND) D2.3(GND) D2.8(GND) D17.2(GND) D18.2(GND) D19.2(GND) D20.2(GND) D21.2(GND) D22.2(GND) D23.2(GND) ETH1.MH3(SHIELD) ETH1.MH4(SHIELD) IC1.2(GND) MICROSD.6(VSS) MICROSD.S1(SHIELD) MICROSD.S2(SHIELD) MICROSD.S3(SHIELD) MICROSD.S4(SHIELD) ; also sheet 1,2,3,4,6,7
N$4: C11.1 ETH1.CT1 ETH1.CT2 ETH1.CT3 ETH1.CT4
N$5: ETH1.17 R9.1
N$8: ETH1.19 R8.2
SD_CLK: D21.1(I/O) MICROSD.5(CLK) ; also sheet 1
SD_CMD: D19.1(I/O) MICROSD.3(CMD) ; also sheet 1
SD_DAT0: D22.1(I/O) MICROSD.7(DAT0) ; also sheet 1
SD_DAT1: D23.1(I/O) MICROSD.8(DAT1) ; also sheet 1
SD_DAT2: D17.1(I/O) MICROSD.1(DAT2) ; also sheet 1
SD_DAT3: D18.1(I/O) MICROSD.2(CD/DAT3) ; also sheet 1
SD_PWR: C10.1 C49.1 C50.1 D20.1(I/O) IC1.1(OUT) MICROSD.4(VDD) TP-VSD.TP
SD_PWR_ON: IC1.4(EN) ; also sheet 1
TR0_TAP: ETH1.VC1 POE.3
TR1_TAP: ETH1.VC2 POE.1
TR2_TAP: ETH1.VC3 POE.2
TR3_TAP: ETH1.VC4 POE.4
Unconnected: IC1.3(NFLG)

### Notes on the sheet
- 1000 BASE ETHERNET
- MICRO-SD SOCKET

## Sheet 6 of 7: GPIO AND POWER
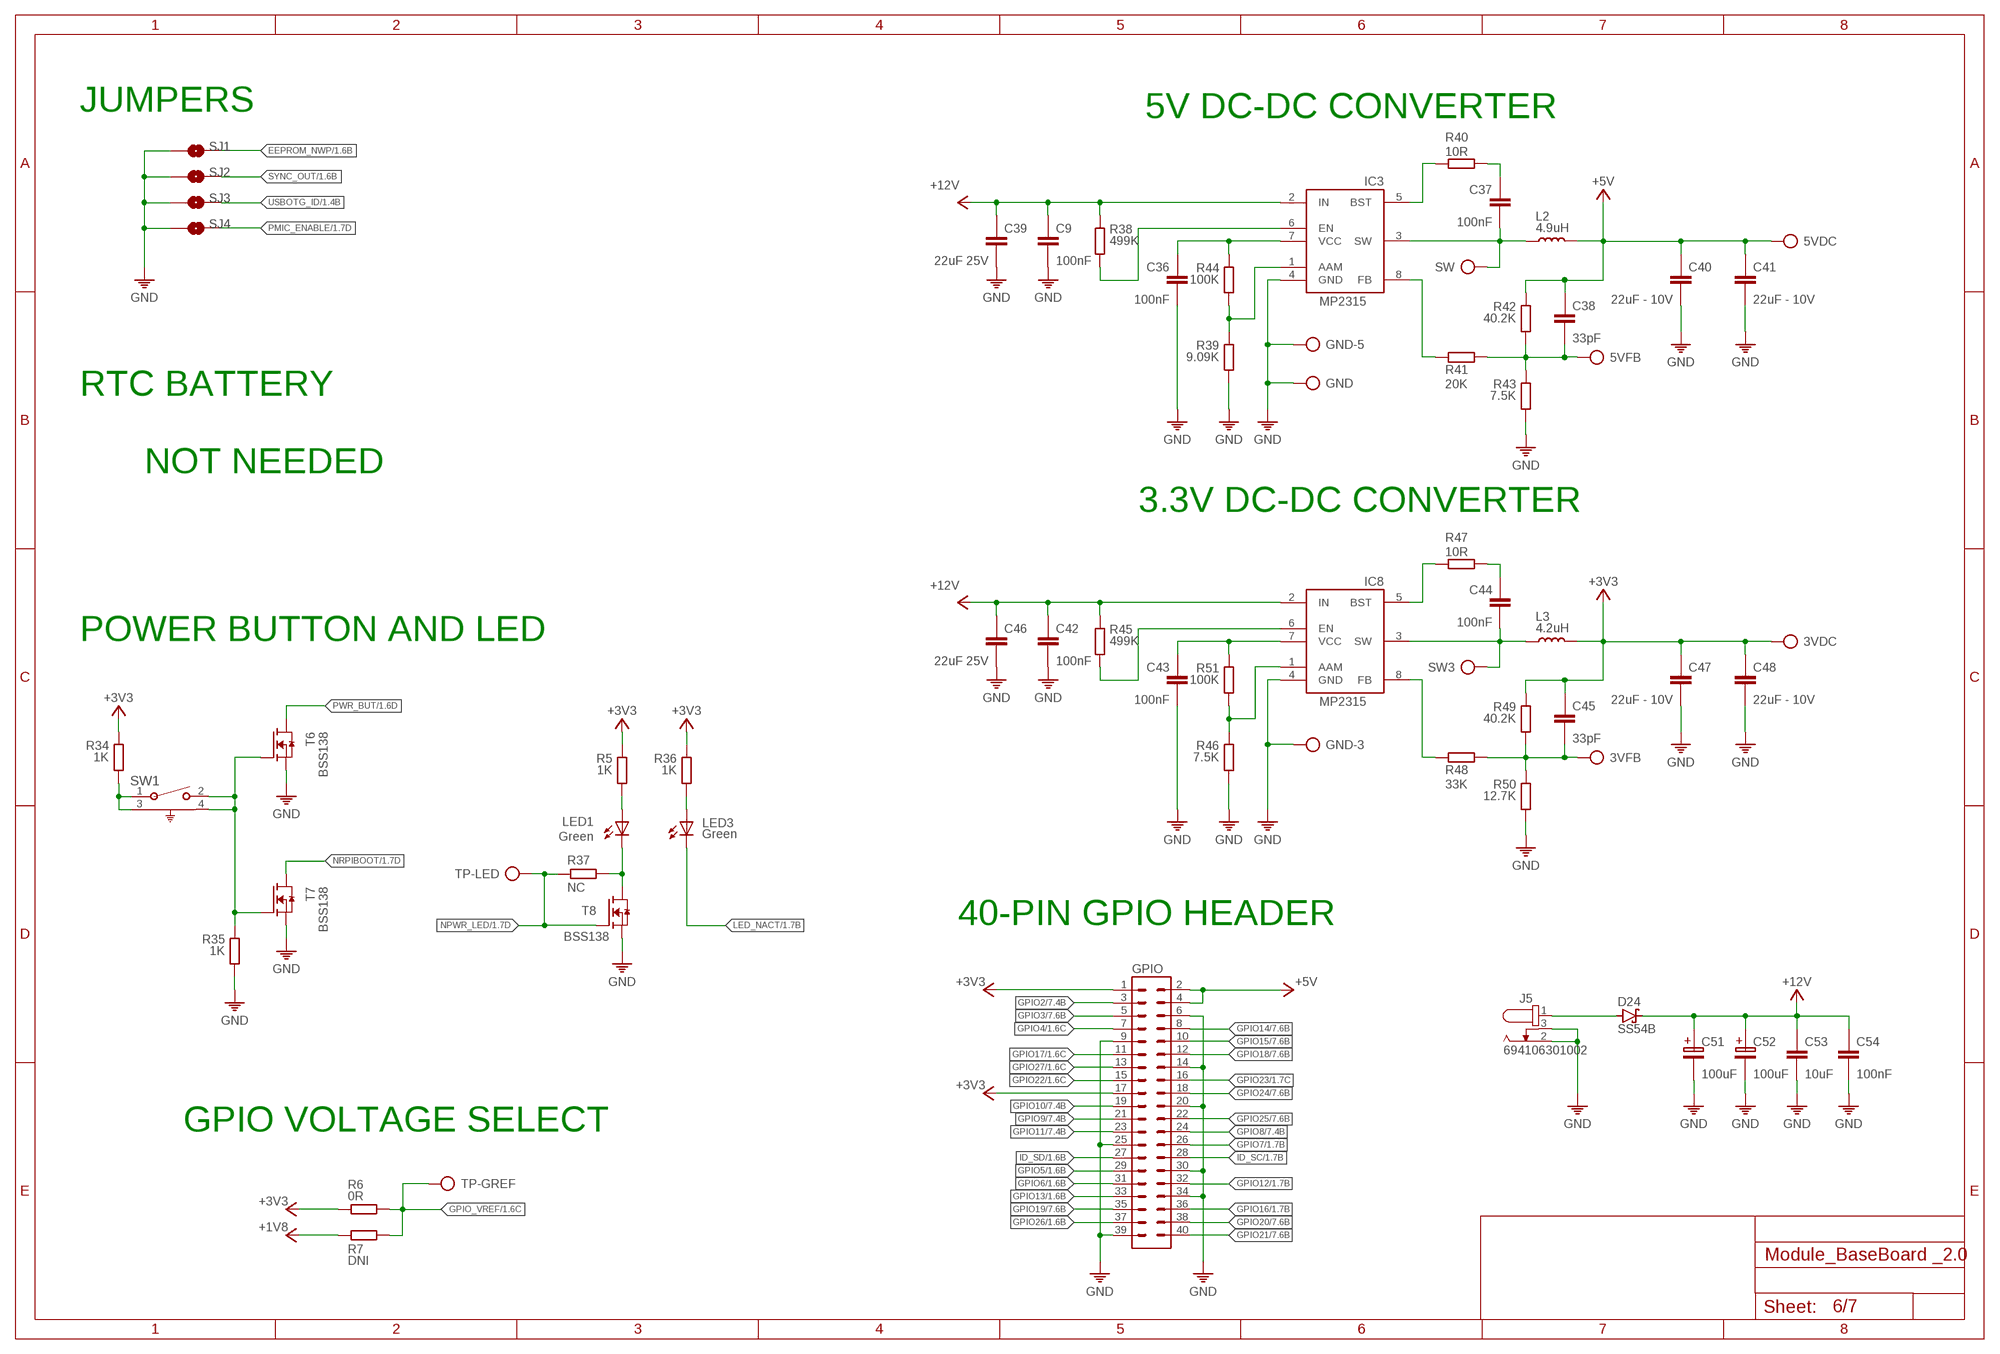
[diagram p5: schematic, sheet 6]

### Parts
3VDC  TP  [TP]
3VFB  TP  [TP]
5VDC  TP  [TP]
5VFB  TP  [TP]
C9  100nF  C0402  [0402]
C36  100nF  C0402  [0402]
C37  100nF  C0402  [0402]
C38  33pF  C0402  [0402]
C39  22uF 25V  C-1206  [C1206]
C40  22uF - 10V  C-1206  [C1206]
C41  22uF - 10V  C-1206  [C1206]
C42  100nF  C0402  [0402]
C43  100nF  C0402  [0402]
C44  100nF  C0402  [0402]
C45  33pF  C0402  [0402]
C46  22uF 25V  C-1206  [C1206]
C47  22uF - 10V  C-1206  [C1206]
C48  22uF - 10V  C-1206  [C1206]
C51  100uF  CPOL  [100UF-16V]
C52  100uF  CPOL  [100UF-16V]
C53  10uF  C-1206  [C1206]
C54  100nF  C-1206  [C1206]
D24  SS54B  [SMB]
GND  TP  [TP]
GND-3  TP  [TP]
GND-5  TP  [TP]
GPIO  CON-2X20  [2X20]
IC3  MP2315GJ-Z  MP2315TSOT23-8  [SOT65P280X110-8N]
IC8  MP2315S  MP2315TSOT23-8  [SOT65P280X110-8N]
J5  694106301002  694106301002  [694106301002]
L2  4.9uH  L  [SRR5228A]
L3  4.2uH  L  [SRR5228A]
LED1  Green  LEDCHIPLED_0805  [CHIPLED_0805]
LED3  Green  LEDCHIPLED_0805  [CHIPLED_0805]
R5  1K  R0402  [0402]
R6  0R  R0402  [0402]
R7  DNI  R0402  [0402]
R34  1K  R0402  [0402]
R35  1K  R0402  [0402]
R36  1K  R0402  [0402]
R37  NC  R0402  [0402]
R38  499K  R0402  [0402]
R39  9.09K  R0402  [0402]
R40  10R  R0402  [0402]
R41  20K  R0402  [0402]
R42  40.2K  R0402  [0402]
R43  7.5K  R0402  [0402]
R44  100K  R0402  [0402]
R45  499K  R0402  [0402]
R46  7.5K  R0402  [0402]
R47  10R  R0402  [0402]
R48  33K  R0402  [0402]
R49  40.2K  R0402  [0402]
R50  12.7K  R0402  [0402]
R51  100K  R0402  [0402]
SJ1  SOLDERJUMPERNO  [SJ_2S-NO]
SJ2  SOLDERJUMPERNO  [SJ_2S-NO]
SJ3  SOLDERJUMPERNO  [SJ_2S-NO]
SJ4  SOLDERJUMPERNO  [SJ_2S-NO]
SW  TP  [TP]
SW1  1825027-8  [SW2_1825027-C_TEC]
SW3  TP  [TP]
T6  BSS138  [SOT23]
T7  BSS138  [SOT23]
T8  BSS138  [SOT23]
TP-GREF  TP  [TP]
TP-LED  TP  [TP]

### Nets
5VFB: 5VFB.TP C38.2 R41.2 R42.2 R43.1
+1V8: R7.1 ; also sheet 1
+3V3: 3VDC.TP C45.1 C47.1 C48.1 GPIO.1 GPIO.17 L3.2 R5.1 R6.1 R34.1 R36.1 R49.1 ; also sheet 1,2,3,4,5,7
+5V: 5VDC.TP C38.1 C40.1 C41.1 GPIO.2 GPIO.4 L2.2 R42.1 ; also sheet 1,2,3,4,7
+12V: C9.1 C39.1 C42.1 C46.1 C51.1 C52.1 C53.1 C54.1 D24.C IC3.2(IN) IC8.2(IN) R38.1 R45.1
EEPROM_NWP: SJ1.2 ; also sheet 1
GND: C9.2 C36.2 C39.2 C40.2 C41.2 C42.2 C43.2 C46.2 C47.2 C48.2 C51.2 C52.2 C53.2 C54.2 GND-3.TP GND-5.TP GND.TP GPIO.6 GPIO.9 GPIO.14 GPIO.20 GPIO.25 GPIO.30 GPIO.34 GPIO.39 IC3.4(GND) IC8.4(GND) J5.2 J5.3 R35.2 R39.2 R43.2 R46.2 R50.2 SJ1.1 SJ2.1 SJ3.1 SJ4.1 T6.2(S) T7.2(S) T8.2(S) ; also sheet 1,2,3,4,5,7
GPIO2: GPIO.3 ; also sheet 1,7
GPIO3: GPIO.5 ; also sheet 1,7
GPIO4: GPIO.7 ; also sheet 1
GPIO5: GPIO.29 ; also sheet 1
GPIO6: GPIO.31 ; also sheet 1
GPIO7: GPIO.26 ; also sheet 1
GPIO8: GPIO.24 ; also sheet 1,7
GPIO9: GPIO.21 ; also sheet 1,7
GPIO10: GPIO.19 ; also sheet 1,7
GPIO11: GPIO.23 ; also sheet 1,7
GPIO12: GPIO.32 ; also sheet 1
GPIO13: GPIO.33 ; also sheet 1
GPIO14: GPIO.8 ; also sheet 1,7
GPIO15: GPIO.10 ; also sheet 1,7
GPIO16: GPIO.36 ; also sheet 1
GPIO17: GPIO.11 ; also sheet 1
GPIO18: GPIO.12 ; also sheet 1,7
GPIO19: GPIO.35 ; also sheet 1,7
GPIO20: GPIO.38 ; also sheet 1,7
GPIO21: GPIO.40 ; also sheet 1,7
GPIO22: GPIO.15 ; also sheet 1
GPIO23: GPIO.16 ; also sheet 1
GPIO24: GPIO.18 ; also sheet 1,7
GPIO25: GPIO.22 ; also sheet 1,7
GPIO26: GPIO.37 ; also sheet 1
GPIO27: GPIO.13 ; also sheet 1
GPIO_VREF: R6.2 R7.2 TP-GREF.TP ; also sheet 1,3
ID_SC: GPIO.28 ; also sheet 1,3
ID_SD: GPIO.27 ; also sheet 1,3
LED_NACT: LED3.C ; also sheet 1
N$2: LED1.A R5.2
N$3: LED3.A R36.2
N$22: R34.2 SW1.1 SW1.3
N$23: LED1.C R37.2 T8.3(D)
N$24: R35.1 SW1.2 SW1.4 T6.1(G) T7.1(G)
N$25: IC3.5(BST) R40.2
N$26: IC3.8(FB) R41.1
N$27: C37.1 R40.1
N$28: IC3.6(EN) R38.2
N$29: C36.1 IC3.7(VCC) R44.1
N$30: D24.A J5.1
N$38: IC8.5(BST) R47.2
N$39: IC8.8(FB) R48.1
N$41: C44.1 R47.1
N$42: 3VFB.TP C45.2 R48.2 R49.2 R50.1
N$43: IC8.6(EN) R45.2
N$44: C43.1 IC8.7(VCC) R51.1
N$45: IC3.1(AAM) R39.1 R44.2
N$46: IC8.1(AAM) R46.1 R51.2
NPWR_LED: R37.1 T8.1(G) TP-LED.TP ; also sheet 1
NRPIBOOT: T7.3(D) ; also sheet 1
PMIC_ENABLE: SJ4.2 ; also sheet 1
PWR_BUT: T6.3(D) ; also sheet 1
SW3: C44.2 IC8.3(SW) L3.1 SW3.TP
SW5: C37.2 IC3.3(SW) L2.1 SW.TP
SYNC_OUT: SJ2.2 ; also sheet 1
USBOTG_ID: SJ3.2 ; also sheet 1

### Notes on the sheet
- JUMPERS | 5V DC-DC CONVERTER
- RTC BATTERY
- NOT NEEDED
- 3.3V DC-DC CONVERTER
- POWER BUTTON AND LED
- 40-PIN GPIO HEADER
- GPIO VOLTAGE SELECT

## Sheet 7 of 7
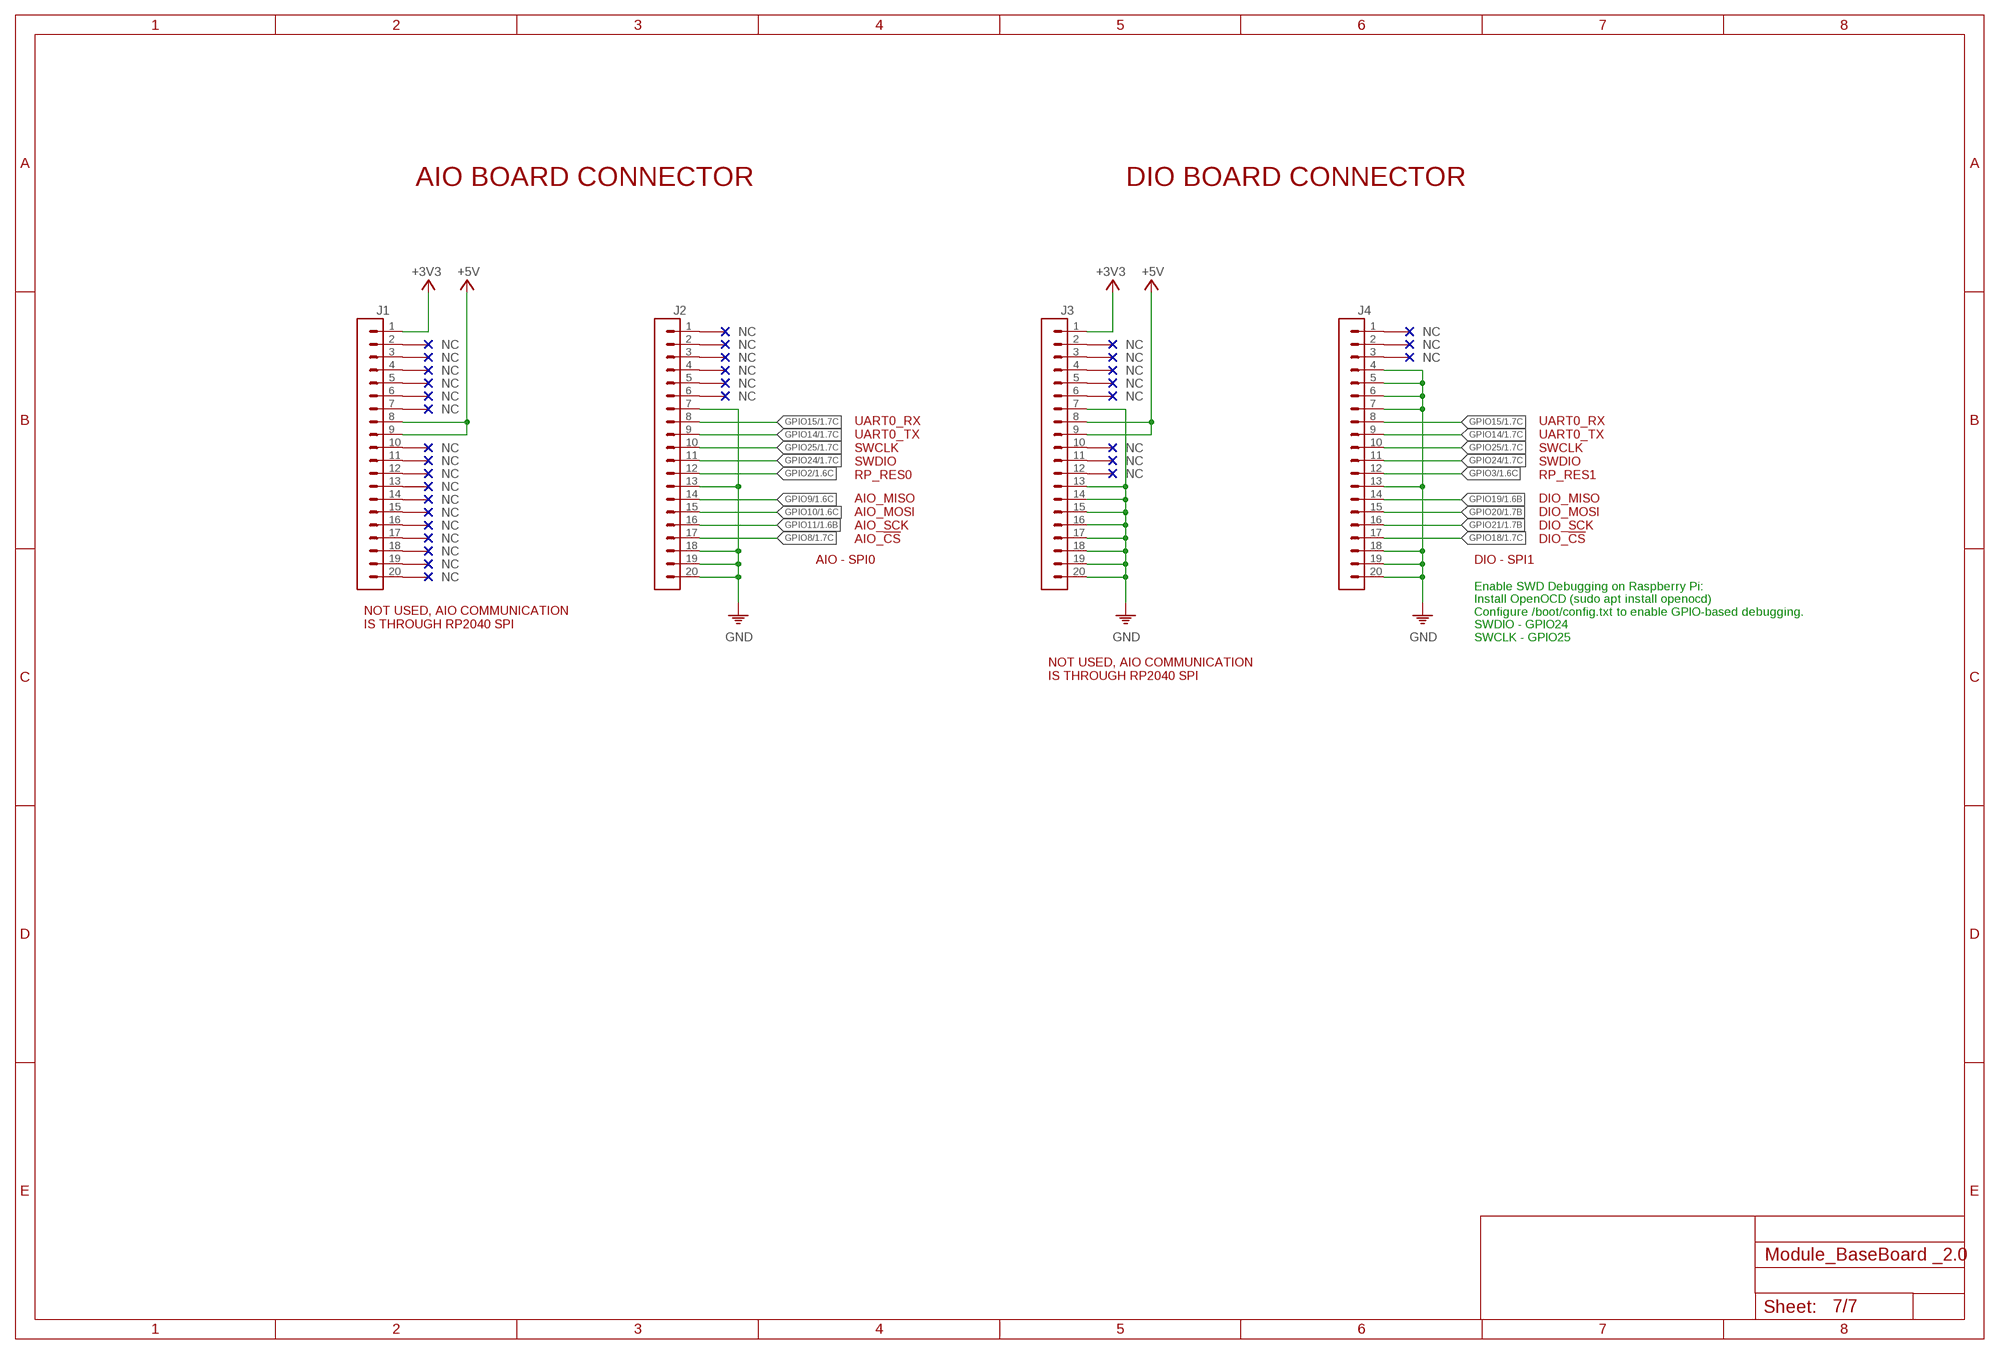
[diagram p6: schematic, sheet 7]

### Parts
J1  CON-1X20  [1X20]
J2  CON-1X20  [1X20]
J3  CON-1X20  [1X20]
J4  CON-1X20  [1X20]

### Nets
+3V3: J1.1 J3.1 ; also sheet 1,2,3,4,5,6
+5V: J1.8 J1.9 J3.8 J3.9 ; also sheet 1,2,3,4,6
GND: J2.7 J2.13 J2.18 J2.19 J2.20 J3.7 J3.13 J3.14 J3.15 J3.16 J3.17 J3.18 J3.19 J3.20 J4.4 J4.5 J4.6 J4.7 J4.13 J4.18 J4.19 J4.20 ; also sheet 1,2,3,4,5,6
GPIO2: J2.12 ; also sheet 1,6
GPIO3: J4.12 ; also sheet 1,6
GPIO8: J2.17 ; also sheet 1,6
GPIO9: J2.14 ; also sheet 1,6
GPIO10: J2.15 ; also sheet 1,6
GPIO11: J2.16 ; also sheet 1,6
GPIO14: J2.9 J4.9 ; also sheet 1,6
GPIO15: J2.8 J4.8 ; also sheet 1,6
GPIO18: J4.17 ; also sheet 1,6
GPIO19: J4.14 ; also sheet 1,6
GPIO20: J4.15 ; also sheet 1,6
GPIO21: J4.16 ; also sheet 1,6
GPIO24: J2.11 J4.11 ; also sheet 1,6
GPIO25: J2.10 J4.10 ; also sheet 1,6
Unconnected: J1.2 J1.3 J1.4 J1.5 J1.6 J1.7 J1.10 J1.11 J1.12 J1.13 J1.14 J1.15 J1.16 J1.17 J1.18 J1.19 J1.20 J2.1 J2.2 J2.3 J2.4 J2.5 J2.6 J3.2 J3.3 J3.4 J3.5 J3.6 J3.10 J3.11 J3.12 J4.1 J4.2 J4.3

### Notes on the sheet
- AIO BOARD CONNECTOR | DIO BOARD CONNECTOR
- UART0_RX
  UART0_TX
  SWCLK
  SWDIO
  RP_RES0
- UART0_RX
  UART0_TX
  SWCLK
  SWDIO
  RP_RES1
- AIO_MISO
  AIO_MOSI
  AIO_SCK
  AIO_!CS
- DIO_MISO
  DIO_MOSI
  DIO_SCK
  DIO_!CS
- AIO - SPI0 | DIO - SPI1
- NOT USED, AIO COMMUNICATION
  IS THROUGH RP2040 SPI
- Enable SWD Debugging on Raspberry Pi:
  Install OpenOCD (sudo apt install openocd)
  Configure /boot/config.txt to enable GPIO-based debugging.
  SWDIO - GPIO24
  SWCLK - GPIO25
- NOT USED, AIO COMMUNICATION
  IS THROUGH RP2040 SPI

## Library data of the parts
3VDC 3VFB 5VDC 5VFB GND GND-3 GND-5 SW SW3 TP-5VHD TP-5VP TP-GREF TP-HUB TP-LED TP-LX TP-M2CLK TP-M2FB TP-VBUS TP-VM2 TP-VSD TP_5VP TP_5VP1 = ds_passive:TP
2230 2242 2260 2280 = Wurth_Assembly_WA-SMSI:WA-SMSI_9774XXX243: WA-SMSI SMT Steel Spacer, M2 Thread Internal Applications Assembling of PCBs to housing and to other PCBs For Distances from 1 to 8 mm Fast and precise process Strong holding forces and torques Highest process reliability Instant removable Polyimide Tape Properties Material Steel Surface Tin Ti M2 Solder Paste Thickness 150 µm Tightening Torque (Value) 0.2 N*m General Information Operating Temperature -55 up to +150 °C <https://www.we-online.com/catalog/media/o92910v209%20Family_WA-SMSI_M2-M2.5.jpg> Details see: https://www.we-online.com/katalog/en/SMSI_SMT_STEEL_SPACER_M2_THREAD_INTERNAL Updated by Ella Wu 2020-06-03 2021(C) Wurth Elektronik; DATASHEET-URL: https://www.we-online.com/catalog/datasheet/9774010243.pdf; INNER-DIAMETER: 2.8mm; INNER-THREAD-LENGTH: -; OUTER-DIAMETER: 4.35mm; PART-NUMBER: 9774010243; PIN-LENGTH: 1mm; THREAD: M2
C1-C7 C9-C27 C32-C34 C36-C50 C53-C56 = ds_passive:C
C8 C35 C51 C52 = ds_passive:CPOL
D1-D4 D7-D9 D13-D16 = ds_ic_peripherals:TPD4EUSB30: TPDxEUSB30 2-, 4-Channel ESD Protection for Super-Speed USB 3.0 Interface
D17-D23 = Wurth_EMC Components_WE-TVS:WE-TVS_DFN1610-2L_824032815: WE-TVS TVS Diode – Standard Series Characteristics Fast turn-on Low clamping voltage High ESD withstand voltage Uni- or bidirectional protection Small package Epoxy flame resistant UL94 V-0 Applications DC power supply USB Power Delivery (PD) Headsets and accessories PDAs Digital cameras MP3-Player Touch Panels Notebooks ESD, EFT and Surge Protection ESD protection in accordance with EN 61000-4-2 – 8 kV contact discharge – 15 kV air discharge <https://www.we-online.com/catalog/media/o106433v209%20Family_WE-TVS_Standard.jpg> Details see: https://www.we-online.com/catalog/en/WE-TVS Updated by Ella Wu 2019-07-12 2019 (C) Wurth Elektronik; C-CH: 140pF; CHANNELS: 1; DATASHEET-URL: https://www.we-online.com/catalog/datasheet/824032815.pdf; IPEAK: 100A; MOUNT: SMT; PART-NUMBER: 824032815; VBR: 6V
D24 = Diodes:SS54B: SURFACE MOUNT SCHOTTKY BARRIER RECTIFIERS Manufacturer's datasheet <http://www.pdc.com.tw/product/PDF/Short%20Form/SURFACE%20MOUNT%20DEVICE/SURFACE%20MOUNT%20SCHOTTKY%20BARRIER%20RECTIFIERS/SS52B~SS510B.pdf>; CREATED_BY: PCBLayout.com; MANUFACTURER: JCET; MPN: SS54B; PACKAGE: SMB
DISP0 = ds_con:FH12-22S-0.5SVA
ETH1 = ds_con:RJ45-CAT6-POE: Right Angle 1G Mag Jack w/ POE Tab Up, Shielded w/ EMI Fingers, LEDs
GPIO = ds_con:CON-2X20
HDMI2 = Wurth_Connectors_WR-HDMI:685119136923: WR-COM Mini HDMI SMT Horizontal <https://www.we-online.com/components/media/o33017v209%20Family_WR-COM_685119136923.jpg> Details see: www.we-online.com/en/components/products/COM_MINI_SMT_HORIZONTAL <www.we-online.com/catalog/COM_MINI_SMT_HORIZONTAL/?utm_source=eagle_model&utm_medium=description_link&utm_campaign=eisos_eagle> Updated by Ella Wu 2023-05-16 2023(C) Würth Elektronik; DATASHEET-URL: https://www.we-online.com/redexpert/spec/685119136923?ae; GERDER: Receptacle; MOUNT: SMT; PART-NUMBER: 685119136923; PINS: 19; RATED-CURRENT: 0.5A; TYPE: Horizontal; WORKING-VOLTAGE: 40VAC
IC1 = ds_ic_peripherals:RT9742GGJ5: 70mΩ/55mΩ, 3A/2.5A/2A/1.5A/1A/0.5A High-Side Power Switches with Flag
IC2 IC7 = ds_ic_peripherals:AP22653W6: PRECISION ADJUSTABLE CURRENT-LIMITED POWER SWITCHES
IC3 IC8 = ds_ic_vreg:MP2315: Description The MP2315 is a high frequency synchronous rectified step-down switch mode converter with built in internal power MOSFETs. It offers a very compact solution to achieve 3A continuous output current over a wide input supply range with excellent load and line regulation. The MP2315 has synchronous mode operation for higher efficiency over output current load range. Current mode operation provides fast transient response and eases loop stabilization. Full protection features include OCP and thermal shut down.
IC4 = ds_ic_peripherals:RT9742: 70mΩ/55mΩ, 3A/2.5A/2A/1.5A/1A/0.5A High-Side Power Switches with Flag
IC5 = ds_ic_vreg:AP3441SHE-7B: 1MHZ, 3A STEP-DOWN DC-DC BUCK CONVERTER
IC6 = ds_ic_peripherals:CH334
ID POE = ds_con:CON-2X2
J1-J4 = ds_con:CON-1X20
J5 = Wurth_Connectors_WR-DC:694106301002: WR-DC DC Power Jack Right Angled (6.4) KIND PROPERTIES Quality Class 5 000 Mating cycles Type Right Angled MATERIAL PROPERTIES Insulator Material PA66 Insulator Flammability Rating UL94 V-0 Color Black Contact Material Copper Alloy Contact Type Stamped Center Pin Plating Gold Center Pin Terminal Plating Tin Tip Spring Material Tin Shunt Terminal Plating Tin GENERAL INFORMATION Operating Temperature -40 up to +85 °C Compliance RoHS ELECTRICAL PROPERTIES IR 1 5 A Working Voltage 30 V (AC) Withstanding Voltage 500 V (AC) Contact Resistance 50 mΩ RISO 100 MΩ PACKAGING PROPERTIES Packaging Bag <https://www.we-online.com/catalog/media/o59009v209%20Family_WR-DC_DC_Power_Jack_Right_Angled_THT_69410x301002.jpg> Details see: https://www.we-online.com/catalog/en/DC_RIGHT_ANGLED_6_4_69410X301002 Updated by Ella Wu 2021-09-30 2021(C) Wurth Elektronik; DATASHEET-URL: https://www.we-online.com/catalog/datasheet/694106301002.pdf; IR: 5A; MOUNT: THT; PART-NUMBER: 694106301002; TYPE: Right Angled; WORKING-VOLTAGE: 30V(AC)
JUSB4 = ds_con:CON-1X4
L1-L3 = ds_passive:L
LED1-LED3 = led:LED: LED OSRAM: - CHIPLED LG R971, LG N971, LY N971, LG Q971, LY Q971, LO R971, LY R971 LH N974, LH R974 LS Q976, LO Q976, LY Q976 LO Q996 - Hyper CHIPLED LW Q18S LB Q993, LB Q99A, LB R99A - SideLED LS A670, LO A670, LY A670, LG A670, LP A670 LB A673, LV A673, LT A673, LW A673 LH A674 LY A675 LS A676, LA A676, LO A676, LY A676, LW A676 LS A679, LY A679, LG A679 - Hyper Micro SIDELED® LS Y876, LA Y876, LO Y876, LY Y876 LT Y87S - SmartLED LW L88C, LW L88S LB L89C, LB L89S, LG L890 LS L89K, LO L89K, LY L89K LS L896, LA L896, LO L896, LY L896 - TOPLED LS T670, LO T670, LY T670, LG T670, LP T670 LSG T670, LSP T670, LSY T670, LOP T670, LYG T670 LG T671, LOG T671, LSG T671 LB T673, LV T673, LT T673, LW T673 LH T674 LS T676, LA T676, LO T676, LY T676, LB T676, LH T676, LSB T676, LW T676 LB T67C, LV T67C, LT T67C, LS T67K, LO T67K, LY T67K, LW E67C LS E67B, LA E67B, LO E67B, LY E67B, LB E67C, LV E67C, LT E67C LW T67C LS T679, LY T679, LG T679 LS T770, LO T770, LY T770, LG T770, LP T770 LB T773, LV T773, LT T773, LW T773 LH T774 LS E675, LA E675, LY E675, LS T675 LS T776, LA T776, LO T776, LY T776, LB T776 LHGB T686 LT T68C, LB T68C - Hyper Mini TOPLED® LB M676 - Mini TOPLED Santana® LG M470 LS M47K, LO M47K, LY M47K Source: http://www.osram.convergy.de LUXEON: - LUMILED® LXK2-PW12-R00, LXK2-PW12-S00, LXK2-PW14-U00, LXK2-PW14-V00 LXK2-PM12-R00, LXK2-PM12-S00, LXK2-PM14-U00 LXK2-PE12-Q00, LXK2-PE12-R00, LXK2-PE12-S00, LXK2-PE14-T00, LXK2-PE14-U00 LXK2-PB12-K00, LXK2-PB12-L00, LXK2-PB12-M00, LXK2-PB14-N00, LXK2-PB14-P00, LXK2-PB14-Q00 LXK2-PR12-L00, LXK2-PR12-M00, LXK2-PR14-Q00, LXK2-PR14-R00 LXK2-PD12-Q00, LXK2-PD12-R00, LXK2-PD12-S00 LXK2-PH12-R00, LXK2-PH12-S00 LXK2-PL12-P00, LXK2-PL12-Q00, LXK2-PL12-R00 Source: www.luxeon.com KINGBRIGHT: KA-3528ASYC Source: www.kingbright.com
MICROSD = Wurth_Connectors_WR-CRD:693072010801: WR-CRD Micro SD Card Connector Hinge 8 pins Kind Properties Gender Socket Type Hinge General Information Operating Temperature -25 up to +85 °C Material Properties Insulator Material LCP Insulator Flammability Rating UL94 V-0 Insulator Color Black Contact Material Copper Alloy Contact Plating Selective Gold Contact Type Stamped Shielding Material Stainless Steel Electrical Properties Working Voltage 100 V (AC) Withstanding Voltage 500 V (AC) Contact Resistance 100 mΩ <https://www.we-online.com/components/media/o33063v209%20Family_05_SMT_ZIF_Horizontal_p294_WR-FPC_6871xx182122_4C.jpg> Details see: www.we-online.com/en/components/products/CRD_SD_MICRO_HINGEL_8_PINS Updated by Ella Wu 2020-04-15 2020(C) Wurth Elektronik; DATASHEET-URL: https://www.we-online.com/redexpert/spec/693072010801?ae; GERDER: Socket; IR: 0.5A; MOUNT: SMT; PART-NUMBER: 693072010801; PINS: 8; TYPE: Hinge; WORKING-VOLTAGE: 100V(AC)
PCIE = ds_con:M.2: SM3ZS067U410AMR1000; PCIE-M2: SM3ZS067U410AMR1000
PI1 = ds_ic_peripherals:RASPBERRY_CM5
Q1 Q2 = Transistor:MMBT3906: TRANS PNP 40V 0.2A SOT-23 Manufacturer's datasheet <https://media.digikey.com/pdf/Data%20Sheets/Diodes%20PDFs/MMBT3906.pdf>; CREATED_BY: PCBLayout.com; DIGIKEY_PART_NUMBER: MMBT3906FSCT-ND; MANUFACTURER: ON Semiconductor; MPN: MMBT3906; PACKAGE: SOT-23
R1-R22 R25-R51 = ds_passive:R
SJ1-SJ4 = SparkFun-Retired:SOLDERJUMPER: Solder Jumper Standard SMD solder jumper. Used to automate production. Two varients : Normally Open and Normally Closed are the same, but have different paste layers. NC will have a large amount of paste and should jumper during reflow.
SW1 = ds_passive:1825027-8; COPYRIGHT: Copyright (C) 2025 Ultra Librarian. All rights reserved.; MANUFACTURER_PART_NUMBER: 1825027-8; MFR_NAME: TE Connectivity
T1-T4 T6-T8 = ds_active:BSS138
T5 = ds_active:AO4407A: 30V P-Channel MOSFET; AO4407A: AO4407A
USB2 = Wurth_Connectors_WR-USB:61400826021: WR-COM USB 2.0 Type A Horizontal Dual Stacked Kind Properties Durability:1 500 Mating cycles Quality Class:1 500 Mating cycles Connector Type:USB Gender:Receptacle Type:Stacked Horizontal General Information Operating Temperature:-40up to +105 °C Compliance:RoHS Electrical Properties IR 1:1.5 A Working Voltage:30V (AC) Withstanding Voltage:750 V (AC) Contact Resistance:20 mΩ Material Properties Insulator Material:PBT Insulator Flammability Rating:UL94 V-0 Color:White Cover Material:Brass Cover Plating:Nickel Contact Material:Copper Alloy Contact Plating:Selective Gold Contact Type:Stamped Shielding Material:Brass Shielding Plating:Nickel <https://www.we-online.com/catalog/media/o32989v209%20Family_WR-COM_61400826021.jpg> Details see: https://www.we-online.com/catalog/en/COM_TYPE_A_HORIZONTAL_DUAL_STACKED/ Updated by Yingchun, Shan 2020-01-14 2020 (C) Würth Elektronik; APPLICATION: USB 2.0; DATASHEET-URL: https://www.we-online.com/redexpert/spec/61400826021?ae; GERDER: Receptacle; INTERFACE-TYPE: Type A; IR: 1.5A; MOUNT: THT; PACKAGING: Tray; PART-NUMBER: 61400826021; PINS: 8; TYPE: Stacked Horizontal; WORKING-VOLTAGE: 30V(AC)
USB3 = Wurth_Connectors_WR-USB:692141030100: WR-COM USB 3.0 Type A Stacked Kind Properties Durability:5 000 Mating cycles Quality Class:5 000 Mating cycles Connector Type:USB Gender:Receptacle Type:Stacked Horizontal General Information Operating Temperature:-40up to +85 °C Compliance:RoHS Electrical Properties IR 1:1.8A Working Voltage:30V (AC) Withstanding Voltage:100V (AC) Contact Resistance:50 mΩ Material Properties Insulator Material:LCP Insulator Flammability Rating:UL94 V-0 Color:Blue Contact Material:Phosphor Bronze Contact Plating:Matte Tin over Nickel Contact Type:Stamped Shielding Material:Brass Shielding Material:Matte Tin <https://www.we-online.com/catalog/media/o33031v209%20Family_WR-COM_692141030100.jpg> Details see: https://www.we-online.com/catalog/en/COM_3_0_TYPE_A_STACKED/ Updated by Yingchun, Shan 2020-01-16 2020 (C) Würth Elektronik; APPLICATION: USB 3.0; DATASHEET-URL: https://www.we-online.com/redexpert/spec/692141030100?ae; GERDER: Receptacle; INTERFACE-TYPE: Type A; IR: 1.8A; MOUNT: THT; PACKAGING: Tray; PART-NUMBER: 692141030100; PINS: 18; TYPE: Stacked Horizontal; WORKING-VOLTAGE: 30V(AC)
USBC = Wurth_Connectors_WR-USB:629722000214: WR-COM USB 2.0 Type C Receptacle Horizontal SMT Kind Properties Durability 10 000 Mating cycles Gender Receptacle Type Horizontal General Information Operating Temperature -40 up to +85 °C Electrical Properties Working Voltage 20 V (DC) Withstanding Voltage 100 V (AC) Contact Resistance 40 mΩ Material Properties Insulator Material LCP Insulator Flammability Rating UL94 V-0 Insulator Color Black Contact Material Brass Contact Plating Gold over Nickel Contact Type Stamped Shielding Material Steel Shielding Plating Nickel (Ni) <https://www.we-online.com/components/media/o689297v209%20family-wr-com-629722000214.jpg> Details see: www.we-online.com/en/components/products/WR-COM_USB_20_TYPE_C_RECEPTACLE_HORIZONTAL_SMT <www.we-online.com/catalog/WR-COM_USB_20_TYPE_C_RECEPTACLE_HORIZONTAL_SMT/?utm_source=eagle_model&utm_medium=description_link&utm_campaign=eisos_eagle> Updated by Ella Wu 2023-05-30 2023 (C) Würth Elektronik; APPLICATION: USB 2.0; DATASHEET-URL: https://www.we-online.com/redexpert/spec/629722000214?ae; GERDER: Receptacle; INTERFACE-TYPE: Type C; IR: 5A; MOUNT: SMT; PACKAGING: Tape and Reel; PART-NUMBER: 629722000214; PINS: 16; TYPE: Horizontal; WORKING-VOLTAGE: 20V(AC)
X1 = Wurth_Quartz Crystals & Oscillators_WE-XTAL:WE-XTAL_CFPX-180: WE-XTAL Quartz Crystal Characteristics SMT and THT models Hermetically sealed Frequencies between 1.8432 MHz and 50 MHz Tolerances down to ±10 ppm available Maximum operating temperatures range: -40 °C to 85 °C Stabilities down to ±10 ppm available Applications Microprocessor Wireless Communication Devices Industrial Devices Wired Communication (e.g. Ethernet and USB) IoT Optical Network Audio and Multimedia Devices Test and Measurement Equipment Navigation and Locators Wearables <https://www.we-online.com/catalog/media/o135919v209%20Family_WE-XTAL_IQXC-42.jpg> Details see: https://www.we-online.com/catalog/en/WE-XTAL Updated by Ella Wu , 2020-11-23 2020 (C) Wurth Elektronik; C-LOAD: 16pF; DATASHEET-URL: https://www.we-online.com/catalog/datasheet/830035266.pdf; MOUNT: SMT; PART-NUMBER: 830035266; STABILITY: 50ppm; TOLERANCE: ±50ppm; VALUE: 24MHz
X2 = ds_passive:CRYSTAL

## Net classes
0 default: width 0.18 mm, drill 0.15 mm, clearance 0.191 mm
1 50R_DIFFPAIR: width 0.446 mm, drill 0.15 mm, clearance 0.191 mm
2 90R_DIFFPAIR: width 0.155 mm, drill 0.15 mm, clearance 0.191 mm
3 100R_DIFFPAIR: width 0.121 mm, drill 0.15 mm, clearance 0.191 mm